# EAGLE design InkTime_Schematic (EAGLE 9.7.0)

## Sheet 1 of 2
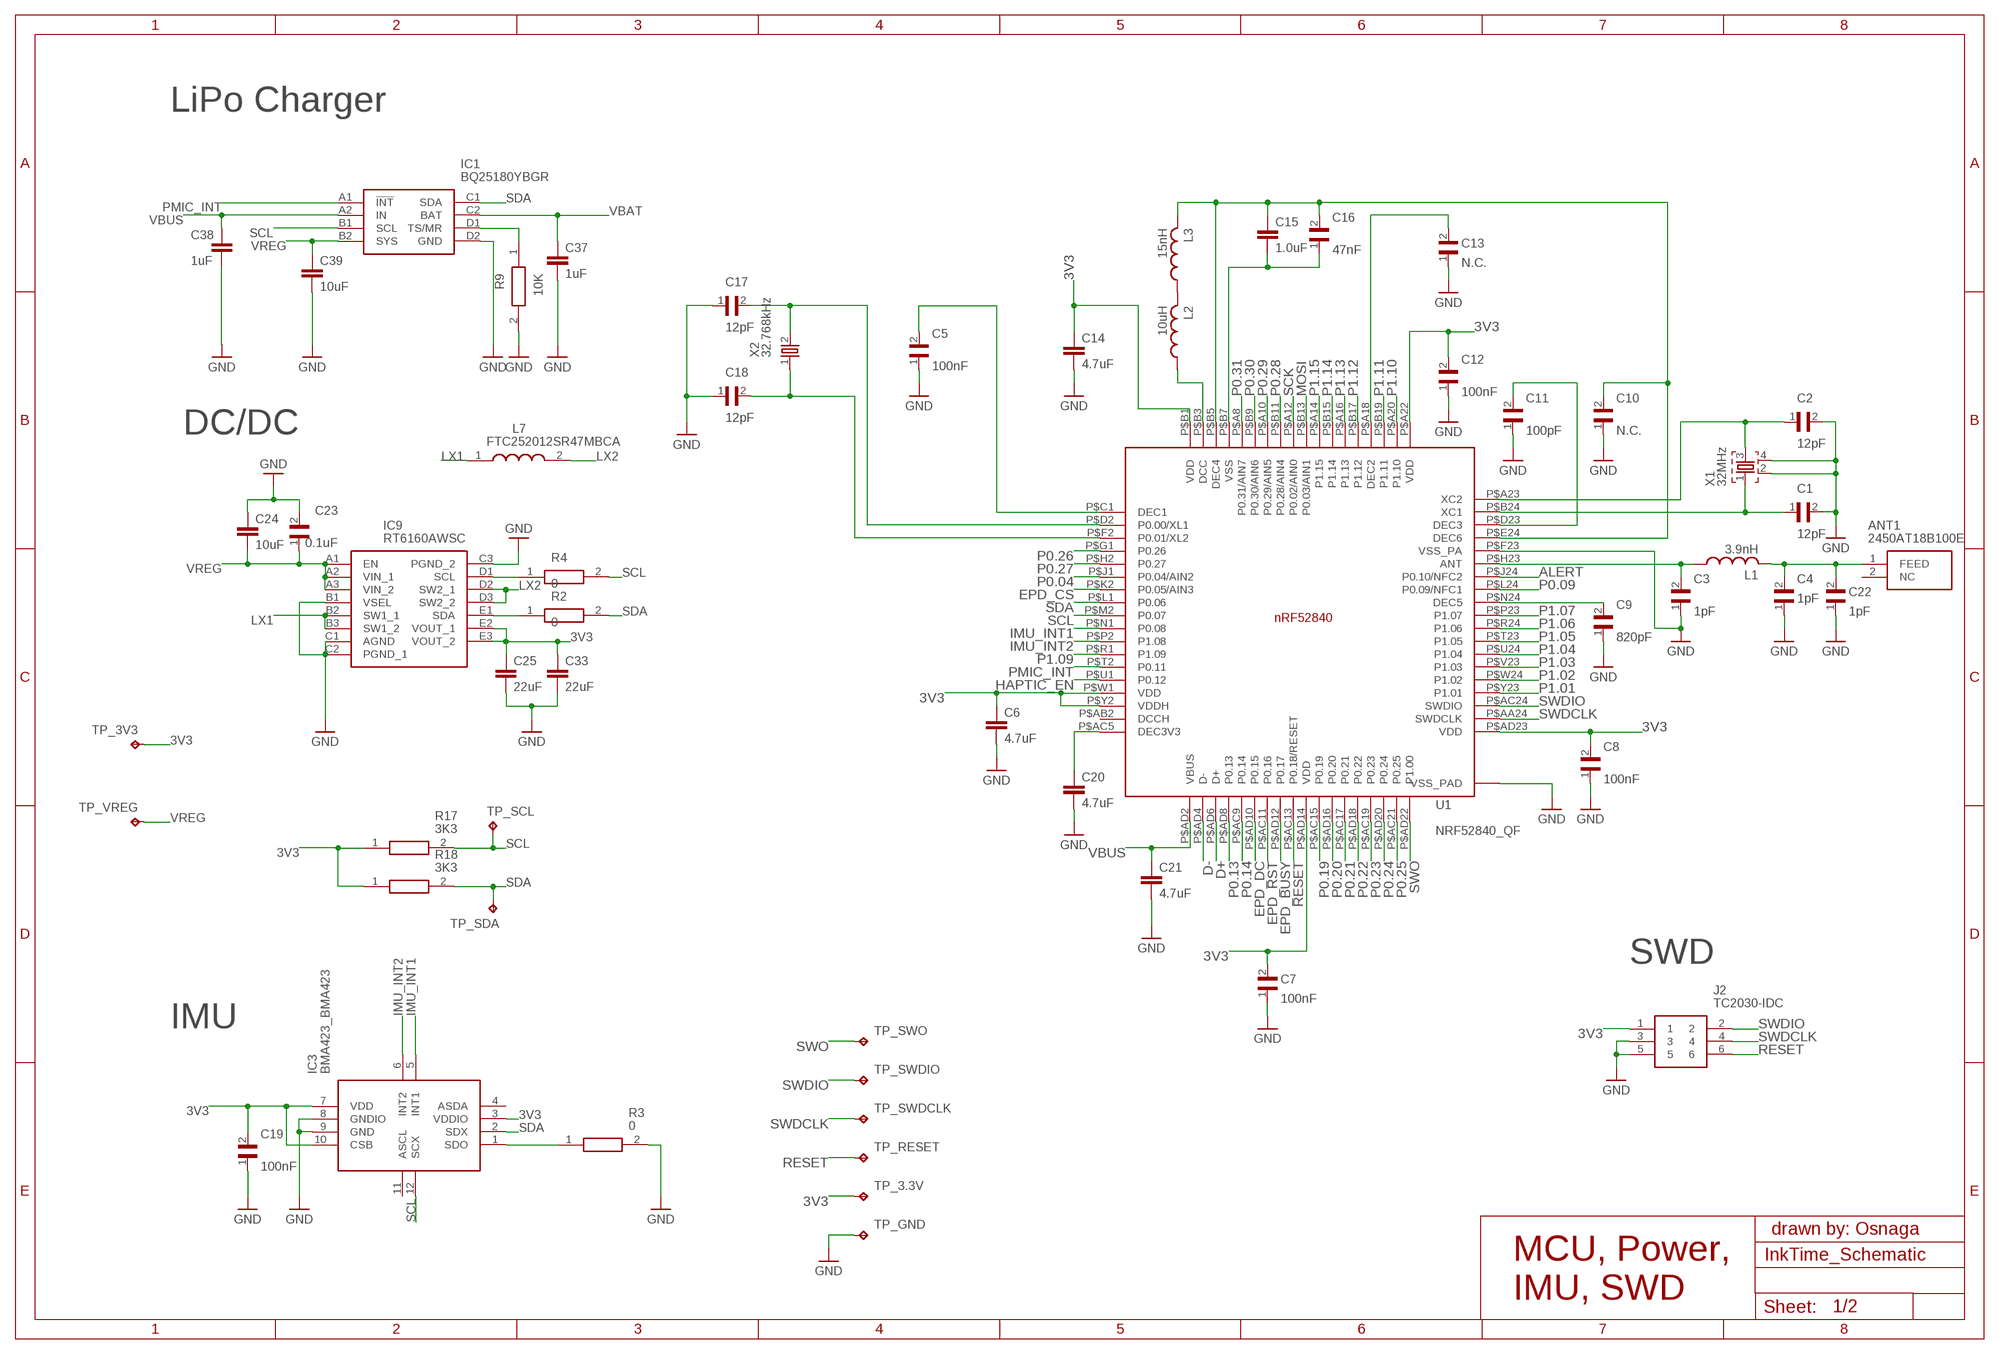
[diagram p0: schematic, sheet 1]

### Parts
ANT1  2450AT18B100E  2450AT18B100E_2450AT18B100E  [2450AT18B100E_ANTC3216X140N]
C1  12pF  GRM011R60J152KE01L_2_GRM011R60J152KE01L  [GRM011R60J152KE01L_2_CAPC0201X13N]
C2  12pF  GRM011R60J152KE01L_2_GRM011R60J152KE01L  [GRM011R60J152KE01L_2_CAPC0201X13N]
C3  1pF  GRM011R60J152KE01L_2_GRM011R60J152KE01L  [GRM011R60J152KE01L_2_CAPC0201X13N]
C4  1pF  GRM011R60J152KE01L_2_GRM011R60J152KE01L  [GRM011R60J152KE01L_2_CAPC0201X13N]
C5  100nF  GRM011R60J152KE01L_2_GRM011R60J152KE01L  [GRM011R60J152KE01L_2_CAPC0201X13N]
C6  4.7uF  PERFECT_0402_CAP_0402  [PERFECT_0402_0402]
C7  100nF  GRM011R60J152KE01L_2_GRM011R60J152KE01L  [GRM011R60J152KE01L_2_CAPC0201X13N]
C8  100nF  GRM011R60J152KE01L_2_GRM011R60J152KE01L  [GRM011R60J152KE01L_2_CAPC0201X13N]
C9  820pF  GRM011R60J152KE01L_2_GRM011R60J152KE01L  [GRM011R60J152KE01L_2_CAPC0201X13N]
C10  N.C.  GRM011R60J152KE01L_2_GRM011R60J152KE01L  [GRM011R60J152KE01L_2_CAPC0201X13N]
C11  100pF  GRM011R60J152KE01L_2_GRM011R60J152KE01L  [GRM011R60J152KE01L_2_CAPC0201X13N]
C12  100nF  GRM011R60J152KE01L_2_GRM011R60J152KE01L  [GRM011R60J152KE01L_2_CAPC0201X13N]
C13  N.C.  GRM011R60J152KE01L_2_GRM011R60J152KE01L  [GRM011R60J152KE01L_2_CAPC0201X13N]
C14  4.7uF  PERFECT_0402_CAP_0402  [PERFECT_0402_0402]
C15  1.0uF  PERFECT_0402_CAP_0402  [PERFECT_0402_0402]
C16  47nF  GRM011R60J152KE01L_2_GRM011R60J152KE01L  [GRM011R60J152KE01L_2_CAPC0201X13N]
C17  12pF  GRM011R60J152KE01L_2_GRM011R60J152KE01L  [GRM011R60J152KE01L_2_CAPC0201X13N]
C18  12pF  GRM011R60J152KE01L_2_GRM011R60J152KE01L  [GRM011R60J152KE01L_2_CAPC0201X13N]
C19  100nF  GRM011R60J152KE01L_2_GRM011R60J152KE01L  [GRM011R60J152KE01L_2_CAPC0201X13N]
C20  4.7uF  PERFECT_0402_CAP_0402  [PERFECT_0402_0402]
C21  4.7uF  PERFECT_0402_CAP_0402  [PERFECT_0402_0402]
C22  1pF  GRM011R60J152KE01L_2_GRM011R60J152KE01L  [GRM011R60J152KE01L_2_CAPC0201X13N]
C23  0.1uF  GRM011R60J152KE01L_2_GRM011R60J152KE01L  [GRM011R60J152KE01L_2_CAPC0201X13N]
C24  10uF  PERFECT_0402_CAP_0402  [PERFECT_0402_0402]
C25  22uF  PERFECT_0402_CAP_0402  [PERFECT_0402_0402]
C33  22uF  PERFECT_0402_CAP_0402  [PERFECT_0402_0402]
C37  1uF  PERFECT_0402_CAP_0402  [PERFECT_0402_0402]
C38  1uF  PERFECT_0402_CAP_0402  [PERFECT_0402_0402]
C39  10uF  PERFECT_0402_CAP_0402  [PERFECT_0402_0402]
IC1  BQ25180YBGR  BQ25180YBGR_BQ25180YBGR  [BQ25180YBGR_BGA8C40P2X4_100X155X50]
IC3  BMA423_BMA423  [BMA423_BMA423]
IC9  RT6160AWSC  RT6160AWSC_RT6160AWSC  [RT6160AWSC_BGA15C40P3X5_140X230X60]
J2  TC2030-IDC  TC2030-IDC_TC2030-IDC  [TC2030-IDC_TC2030IDC]
L1  3.9nH  NORDIC_NRF_2_INDUCTOR_0201_L  [NORDIC_NRF_2_RESC0201_L]
L2  10uH  NORDIC_NRF_2_INDUCTOR_0201_L  [NORDIC_NRF_2_RESC0201_L]
L3  15nH  NORDIC_NRF_2_INDUCTOR_0201_L  [NORDIC_NRF_2_RESC0201_L]
L7  FTC252012SR47MBCA  MLP2016SR47MT0S1_FTC252012SR47MBCA  [MLP2016SR47MT0S1_INDC2016X100N]
R2  0  CPF0201D7K68C1_CPF0201D7K68C1  [CPF0201D7K68C1_0201]
R3  0  CPF0201D7K68C1_CPF0201D7K68C1  [CPF0201D7K68C1_0201]
R4  0  CPF0201D7K68C1_CPF0201D7K68C1  [CPF0201D7K68C1_0201]
R9  10K  CPF0201D7K68C1_CPF0201D7K68C1  [CPF0201D7K68C1_0201]
R17  3K3  CPF0201D7K68C1_CPF0201D7K68C1  [CPF0201D7K68C1_0201]
R18  3K3  CPF0201D7K68C1_CPF0201D7K68C1  [CPF0201D7K68C1_0201]
TP_3.3V  HECTOR_WATCH_1_TPTP20R  [HECTOR_WATCH_1_TP20R]
TP_3V3  HECTOR_WATCH_1_TPTP20R  [HECTOR_WATCH_1_TP20R]
TP_GND  HECTOR_WATCH_1_TPTP20R  [HECTOR_WATCH_1_TP20R]
TP_RESET  HECTOR_WATCH_1_TPTP20R  [HECTOR_WATCH_1_TP20R]
TP_SCL  HECTOR_WATCH_1_TPTP20R  [HECTOR_WATCH_1_TP20R]
TP_SDA  HECTOR_WATCH_1_TPTP20R  [HECTOR_WATCH_1_TP20R]
TP_SWDCLK  HECTOR_WATCH_1_TPTP20R  [HECTOR_WATCH_1_TP20R]
TP_SWDIO  HECTOR_WATCH_1_TPTP20R  [HECTOR_WATCH_1_TP20R]
TP_SWO  HECTOR_WATCH_1_TPTP20R  [HECTOR_WATCH_1_TP20R]
TP_VREG  HECTOR_WATCH_1_TPTP20R  [HECTOR_WATCH_1_TP20R]
U1  NRF52840_QF  NORDIC_NRF_4_NRF52840_QF  [NORDIC_NRF_4_AQFN50P700X700X85_HS-74N]
X1  32MHz  NORDIC_NRF_XTAL_32MHZ  [NORDIC_NRF_BT-XTAL_2016_N]
X2  32.768kHz  NORDIC_NRF_1_XTAL_32KHZ  [NORDIC_NRF_1_XTAL_3215_N]

### Nets
3V3: C6.1 C7.2 C8.2 C12.2 C14.1 C19.2 C25.1 C33.1 IC3.3(VDDIO) IC3.7(VDD) IC3.10(CSB) IC9.E2(VOUT_1) IC9.E3(VOUT_2) J2.1 R17.1 R18.1 TP_3.3V.TP TP_3V3.TP U1.P$A22(VDD) U1.P$AD14(VDD) U1.P$AD23(VDD) U1.P$B1(VDD) U1.P$W1(VDD) U1.P$Y2(VDDH) ; also sheet 2
ALERT: U1.P$J24(P0.10/NFC2) ; also sheet 2
D+: U1.P$AD6(D+) ; also sheet 2
D-: U1.P$AD4(D-) ; also sheet 2
EPD_BUSY: U1.P$AD12(P0.17) ; also sheet 2
EPD_CS: U1.P$K2(P0.05/AIN3) ; also sheet 2
EPD_DC: U1.P$AD10(P0.15) ; also sheet 2
EPD_RST: U1.P$AC11(P0.16) ; also sheet 2
GND: C1.2 C2.2 C3.1 C4.1 C5.1 C6.2 C7.1 C8.1 C9.1 C10.1 C11.1 C12.1 C13.1 C14.2 C17.1 C18.1 C19.1 C20.2 C21.2 C22.1 C23.2 C24.1 C25.2 C33.2 C37.2 C38.2 C39.2 IC1.D2(GND) IC3.8(GNDIO) IC3.9(GND) IC9.B1(VSEL) IC9.C1(AGND) IC9.C2(PGND_1) IC9.C3(PGND_2) J2.3 J2.5 R3.2 R9.2 TP_GND.TP U1.P$74(VSS_PAD) U1.P$75(VSS_PAD) U1.P$76(VSS_PAD) U1.P$77(VSS_PAD) U1.P$78(VSS_PAD) U1.P$79(VSS_PAD) U1.P$80(VSS_PAD) U1.P$81(VSS_PAD) U1.P$82(VSS_PAD) U1.P$83(VSS_PAD) U1.P$84(VSS_PAD) U1.P$85(VSS_PAD) U1.P$86(VSS_PAD) U1.P$87(VSS_PAD) U1.P$88(VSS_PAD) U1.P$89(VSS_PAD) U1.P$90(VSS_PAD) U1.P$F23(VSS_PA) X1.2 X1.4 ; also sheet 2
HAPTIC_EN: U1.P$U1(P0.12) ; also sheet 2
IMU_INT1: IC3.5(INT1) U1.P$N1(P0.08)
IMU_INT2: IC3.6(INT2) U1.P$P2(P1.08)
LX1: IC9.B2(SW1_1) IC9.B3(SW1_2) L7.1
LX2: IC9.D2(SW2_1) IC9.D3(SW2_2) L7.2
MOSI: U1.P$B13(P0.03/AIN1) ; also sheet 2
N$1: IC9.D1(SCL) R4.1
N$2: IC9.E1(SDA) R2.1
N$3: C20.1 U1.P$AC5(DEC3V3)
N$4: C5.2 U1.P$C1(DEC1)
N$5: IC3.1(SDO) R3.1
N$6: IC1.D1(TS/MR) R9.1
N$7: C17.2 U1.P$D2(P0.00/XL1) X2.2
N$8: L2.2 L3.1
N$9: L2.1 U1.P$B3(DCC)
N$11: C18.2 U1.P$F2(P0.01/XL2) X2.1
N$12: C15.2 C16.1 U1.P$B7(VSS)
N$15: C11.2 U1.P$D23(DEC3)
N$16: C2.1 U1.P$A23(XC2) X1.3
N$17: C1.1 U1.P$B24(XC1) X1.1
N$19: C3.2 L1.1 U1.P$H23(ANT)
N$20: ANT1.1(FEED) C4.2 C22.2 L1.2
N$24: C13.2 U1.P$A18(DEC2)
N$25: C9.2 U1.P$N24(DEC5)
N$35: C10.2 C15.1 C16.2 L3.2 U1.P$B5(DEC4) U1.P$E24(DEC6)
P0.04: U1.P$J1(P0.04/AIN2)
P0.09: U1.P$L24(P0.09/NFC1)
P0.13: U1.P$AD8(P0.13) ; also sheet 2
P0.14: U1.P$AC9(P0.14) ; also sheet 2
P0.19: U1.P$AC15(P0.19)
P0.20: U1.P$AD16(P0.20)
P0.21: U1.P$AC17(P0.21)
P0.22: U1.P$AD18(P0.22)
P0.23: U1.P$AC19(P0.23)
P0.24: U1.P$AD20(P0.24)
P0.25: U1.P$AC21(P0.25)
P0.26: U1.P$G1(P0.26)
P0.27: U1.P$H2(P0.27)
P0.28: U1.P$B11(P0.28/AIN4)
P0.29: U1.P$A10(P0.29/AIN5)
P0.30: U1.P$B9(P0.30/AIN6)
P0.31: U1.P$A8(P0.31/AIN7)
P1.01: U1.P$Y23(P1.01) ; also sheet 2
P1.02: U1.P$W24(P1.02) ; also sheet 2
P1.03: U1.P$V23(P1.03)
P1.04: U1.P$U24(P1.04)
P1.05: U1.P$T23(P1.05)
P1.06: U1.P$R24(P1.06)
P1.07: U1.P$P23(P1.07)
P1.09: U1.P$R1(P1.09)
P1.10: U1.P$A20(P1.10)
P1.11: U1.P$B19(P1.11)
P1.12: U1.P$B17(P1.12)
P1.13: U1.P$A16(P1.13)
P1.14: U1.P$B15(P1.14)
P1.15: U1.P$A14(P1.15)
PMIC_INT: IC1.A1(!INT) U1.P$T2(P0.11)
RESET: J2.6 TP_RESET.TP U1.P$AC13(P0.18/RESET)
SCK: U1.P$A12(P0.02/AIN0) ; also sheet 2
SCL: IC1.B1(SCL) IC3.12(SCX) R4.2 R17.2 TP_SCL.TP U1.P$M2(P0.07) ; also sheet 2
SDA: IC1.C1(SDA) IC3.2(SDX) R2.2 R18.2 TP_SDA.TP U1.P$L1(P0.06) ; also sheet 2
SWDCLK: J2.4 TP_SWDCLK.TP U1.P$AA24(SWDCLK)
SWDIO: J2.2 TP_SWDIO.TP U1.P$AC24(SWDIO)
SWO: TP_SWO.TP U1.P$AD22(P1.00)
VBAT: C37.1 IC1.C2(BAT) ; also sheet 2
VBUS: C21.1 C38.1 IC1.A2(IN) U1.P$AD2(VBUS) ; also sheet 2
VREG: C23.1 C24.2 C39.1 IC1.B2(SYS) IC9.A1(EN) IC9.A2(VIN_1) IC9.A3(VIN_2) TP_VREG.TP
Unconnected: ANT1.2(NC) IC3.4(ASDA) IC3.11(ASCL) U1.P$AB2(DCCH)

### Notes on the sheet
- LiPo Charger
- DC/DC
- SWD
- IMU
- drawn by: Osnaga
- MCU, Power,
  IMU, SWD

## Sheet 2 of 2
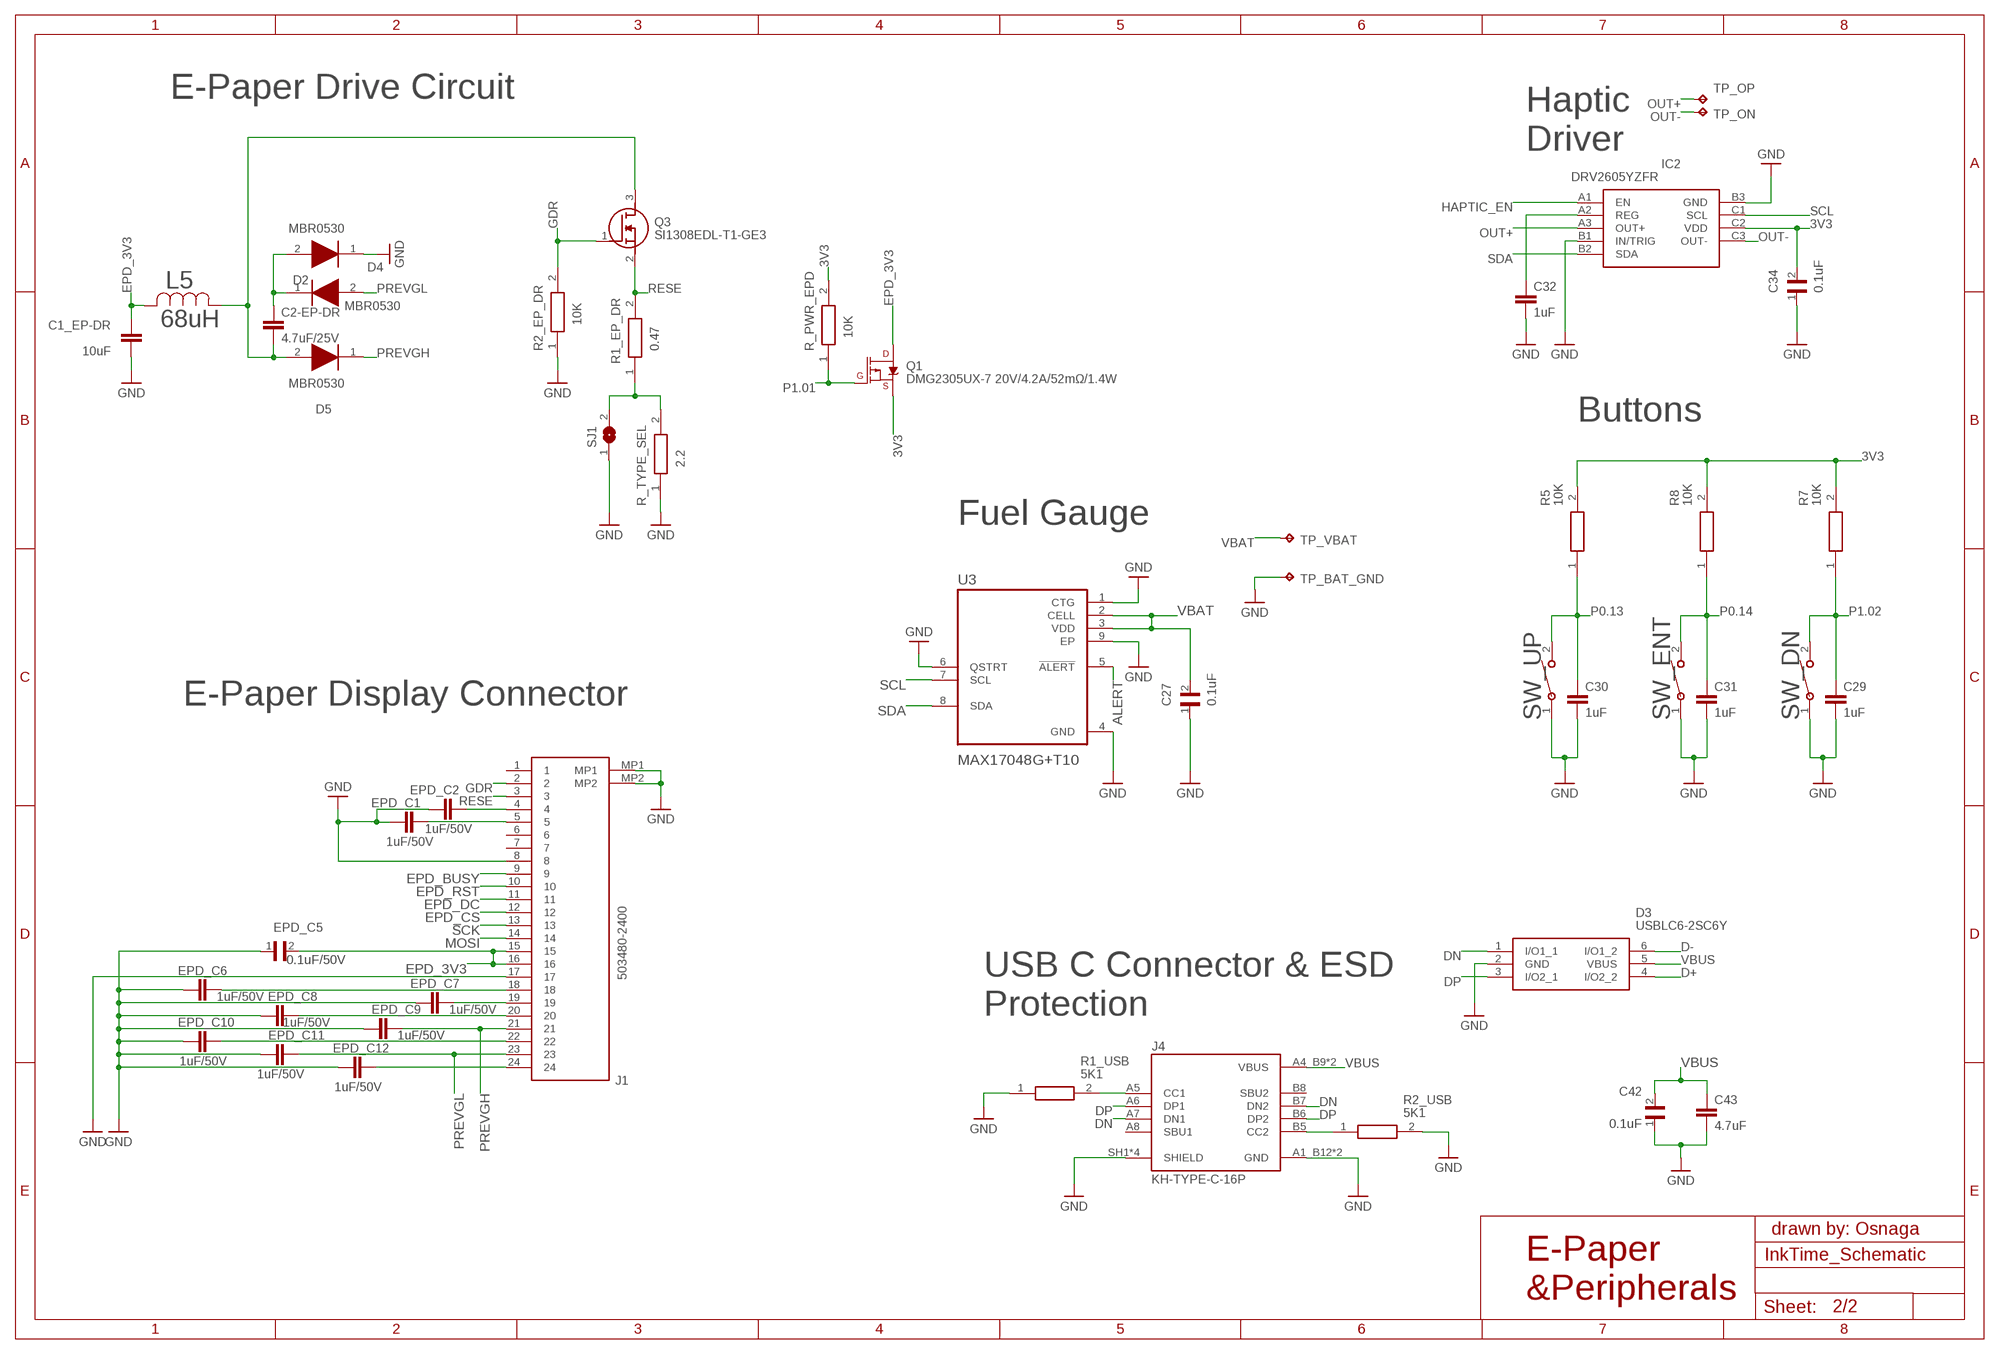
[diagram p1: schematic, sheet 2]

### Parts
C1_EP-DR  10uF  PERFECT_0402_CAP_0402  [PERFECT_0402_0402]
C2-EP-DR  4.7uF/25V  PERFECT_0402_CAP_0402  [PERFECT_0402_0402]
C27  0.1uF  GRM011R60J152KE01L_2_GRM011R60J152KE01L  [GRM011R60J152KE01L_2_CAPC0201X13N]
C29  1uF  PERFECT_0402_CAP_0402  [PERFECT_0402_0402]
C30  1uF  PERFECT_0402_CAP_0402  [PERFECT_0402_0402]
C31  1uF  PERFECT_0402_CAP_0402  [PERFECT_0402_0402]
C32  1uF  PERFECT_0402_CAP_0402  [PERFECT_0402_0402]
C34  0.1uF  GRM011R60J152KE01L_2_GRM011R60J152KE01L  [GRM011R60J152KE01L_2_CAPC0201X13N]
C42  0.1uF  GRM011R60J152KE01L_2_GRM011R60J152KE01L  [GRM011R60J152KE01L_2_CAPC0201X13N]
C43  4.7uF  PERFECT_0402_CAP_0402  [PERFECT_0402_0402]
D2  MBR0530  ESP32_C6_LIBRARY_5_MBR0530  [ESP32_C6_LIBRARY_5_SOD3716X135N]
D3  USBLC6-2SC6Y  ESP32_C6_LIBRARY_3_USBLC6-2SC6Y  [ESP32_C6_LIBRARY_3_SOT95P280X145-6N]
D4  MBR0530  ESP32_C6_LIBRARY_5_MBR0530  [ESP32_C6_LIBRARY_5_SOD3716X135N]
D5  MBR0530  ESP32_C6_LIBRARY_5_MBR0530  [ESP32_C6_LIBRARY_5_SOD3716X135N]
EPD_C1  1uF/50V  PERFECT_0402_CAP_0402  [PERFECT_0402_0402]
EPD_C2  1uF/50V  PERFECT_0402_CAP_0402  [PERFECT_0402_0402]
EPD_C5  0.1uF/50V  GRM011R60J152KE01L_2_GRM011R60J152KE01L  [GRM011R60J152KE01L_2_CAPC0201X13N]
EPD_C6  1uF/50V  PERFECT_0402_CAP_0402  [PERFECT_0402_0402]
EPD_C7  1uF/50V  PERFECT_0402_CAP_0402  [PERFECT_0402_0402]
EPD_C8  1uF/50V  PERFECT_0402_CAP_0402  [PERFECT_0402_0402]
EPD_C9  1uF/50V  PERFECT_0402_CAP_0402  [PERFECT_0402_0402]
EPD_C10  1uF/50V  PERFECT_0402_CAP_0402  [PERFECT_0402_0402]
EPD_C11  1uF/50V  PERFECT_0402_CAP_0402  [PERFECT_0402_0402]
EPD_C12  1uF/50V  PERFECT_0402_CAP_0402  [PERFECT_0402_0402]
IC2  DRV2605YZFR  DRV2605YZFR_DRV2605YZFR  [DRV2605YZFR_BGA9C50P3X3_144X144X62]
J1  503480-2400  503480-2400_503480-2400  [503480-2400_5034802400]
J4  KH-TYPE-C-16P  KH-TYPE-C-16P_KH-TYPE-C-16P  [KH-TYPE-C-16P_KINGHELM_KH-TYPE-C-16P]
L5  68uH  ESP32_C6_LIBRARY_2_744043680IND_4828-WE-TPC_WRE  [ESP32_C6_LIBRARY_2_IND_4828-WE-TPC_WRE]
Q1  DMG2305UX-7 20V/4.2A/52mΩ/1.4W  ESP32_C6_LIBRARY_4_ESP32_WROVER_SPARKFUN-DISCRETESEMI_MOSFET_PCH-DMG2305UX-7  [ESP32_C6_LIBRARY_4_ESP32_C6_LIBRARY_4_ESP32_C6_LIBRARY_4_ESP32_C6_LIBRARY_4_ESP32_WROVER_SPARKFUN-DISCRETESEMI_SOT23-3]
Q3  SI1308EDL-T1-GE3  ESP32_C6_LIBRARY_6_SI1308EDL-T1-GE3  [ESP32_C6_LIBRARY_6_SOT65P210X110-3N]
R1_EP_DR  0.47  CPF0201D7K68C1_CPF0201D7K68C1  [CPF0201D7K68C1_0201]
R1_USB  5K1  CPF0201D7K68C1_CPF0201D7K68C1  [CPF0201D7K68C1_0201]
R2_EP_DR  10K  CPF0201D7K68C1_CPF0201D7K68C1  [CPF0201D7K68C1_0201]
R2_USB  5K1  CPF0201D7K68C1_CPF0201D7K68C1  [CPF0201D7K68C1_0201]
R5  10K  CPF0201D7K68C1_CPF0201D7K68C1  [CPF0201D7K68C1_0201]
R7  10K  CPF0201D7K68C1_CPF0201D7K68C1  [CPF0201D7K68C1_0201]
R8  10K  CPF0201D7K68C1_CPF0201D7K68C1  [CPF0201D7K68C1_0201]
R_PWR_EPD  10K  CPF0201D7K68C1_CPF0201D7K68C1  [CPF0201D7K68C1_0201]
R_TYPE_SEL  2.2  CPF0201D7K68C1_CPF0201D7K68C1  [CPF0201D7K68C1_0201]
SJ1  ESP32_C6_LIBRARY_7_JUMPER_SJ  [ESP32_C6_LIBRARY_7_JUMPER_SJ]
SW_DN  2025-10-22_07-23-44_LIBRARY_EVP-AKE31ASW_EVP-AKE31A_PAN  [2025-10-22_07-23-44_LIBRARY_SW_EVP-AKE31A_PAN]
SW_ENT  2025-10-22_07-23-44_LIBRARY_EVP-AKE31ASW_EVP-AKE31A_PAN  [2025-10-22_07-23-44_LIBRARY_SW_EVP-AKE31A_PAN]
SW_UP  2025-10-22_07-23-44_LIBRARY_EVP-AKE31ASW_EVP-AKE31A_PAN  [2025-10-22_07-23-44_LIBRARY_SW_EVP-AKE31A_PAN]
TP_BAT_GND  HECTOR_WATCH_1_TPTP20R  [HECTOR_WATCH_1_TP20R]
TP_ON  HECTOR_WATCH_1_TPTP20R  [HECTOR_WATCH_1_TP20R]
TP_OP  HECTOR_WATCH_1_TPTP20R  [HECTOR_WATCH_1_TP20R]
TP_VBAT  HECTOR_WATCH_1_TPTP20R  [HECTOR_WATCH_1_TP20R]
U3  MAX17048G+T10  ESP32_C6_LIBRARY_MAX17048G+T10  [ESP32_C6_LIBRARY_SON50P200X200X80-9N]

### Nets
3V3: C34.2 IC2.C2(VDD) Q1.2(S) R5.2 R7.2 R8.2 R_PWR_EPD.2 ; also sheet 1
ALERT: U3.5(!ALERT) ; also sheet 1
D+: D3.4(I/O2_2) ; also sheet 1
D-: D3.6(I/O1_2) ; also sheet 1
DN: D3.1(I/O1_1) J4.A7(DN1) J4.B7(DN2)
DP: D3.3(I/O2_1) J4.A6(DP1) J4.B6(DP2)
EPD_3V3: C1_EP-DR.1 EPD_C5.2 J1.15 J1.16 L5.2 Q1.3(D)
EPD_BUSY: J1.9 ; also sheet 1
EPD_CS: J1.12 ; also sheet 1
EPD_DC: J1.11 ; also sheet 1
EPD_RST: J1.10 ; also sheet 1
GDR: J1.2 Q3.1(G) R2_EP_DR.2
GND: C1_EP-DR.2 C27.1 C29.2 C30.2 C31.2 C32.2 C34.1 C42.1 C43.2 D3.2(GND) D4.1(K) EPD_C1.1 EPD_C2.1 EPD_C5.1 EPD_C6.1 EPD_C7.1 EPD_C8.1 EPD_C9.1 EPD_C10.1 EPD_C11.1 EPD_C12.1 IC2.B1(IN/TRIG) IC2.B3(GND) J1.8 J1.17 J1.MP1 J1.MP2 J4.A1_B12(GND) J4.A12_B1(GND) J4.SH1(SHIELD) J4.SH2(SHIELD) J4.SH3(SHIELD) J4.SH4(SHIELD) R1_USB.1 R2_EP_DR.1 R2_USB.2 R_TYPE_SEL.1 SJ1.1 SW_DN.1 SW_ENT.1 SW_UP.1 TP_BAT_GND.TP U3.1(CTG) U3.4(GND) U3.6(QSTRT) U3.9(EP) ; also sheet 1
HAPTIC_EN: IC2.A1(EN) ; also sheet 1
MOSI: J1.14 ; also sheet 1
N$22: EPD_C6.2 J1.18
N$23: EPD_C7.2 J1.19
N$26: EPD_C8.2 J1.20
N$27: J4.B5(CC2) R2_USB.1
N$28: EPD_C10.2 J1.22
N$30: EPD_C2.2 J1.4
N$31: EPD_C1.2 J1.5
N$32: EPD_C12.2 J1.24
N$33: R1_EP_DR.1 R_TYPE_SEL.2 SJ1.2
N$34: C2-EP-DR.2 D5.2(A) L5.1 Q3.3(D)
N$37: J4.A5(CC1) R1_USB.2
N$39: C2-EP-DR.1 D2.1(K) D4.2(A)
N$43: C32.1 IC2.A2(REG)
OUT+: IC2.A3(OUT+) TP_OP.TP
OUT-: IC2.C3(OUT-) TP_ON.TP
P0.13: C30.1 R5.1 SW_UP.2 ; also sheet 1
P0.14: C31.1 R8.1 SW_ENT.2 ; also sheet 1
P1.01: Q1.1(G) R_PWR_EPD.1 ; also sheet 1
P1.02: C29.1 R7.1 SW_DN.2 ; also sheet 1
PREVGH: D5.1(K) EPD_C9.2 J1.21
PREVGL: D2.2(A) EPD_C11.2 J1.23
RESE: J1.3 Q3.2(S) R1_EP_DR.2
SCK: J1.13 ; also sheet 1
SCL: IC2.C1(SCL) U3.7(SCL) ; also sheet 1
SDA: IC2.B2(SDA) U3.8(SDA) ; also sheet 1
VBAT: C27.2 TP_VBAT.TP U3.2(CELL) U3.3(VDD) ; also sheet 1
VBUS: C42.2 C43.1 D3.5(VBUS) J4.A4_B9(VBUS) J4.A9_B4(VBUS) ; also sheet 1
Unconnected: J1.1 J1.6 J1.7 J4.A8(SBU1) J4.B8(SBU2)

### Notes on the sheet
- E-Paper Drive Circuit
- Haptic
  Driver
- Buttons
- Fuel Gauge
- E-Paper Display Connector
- USB C Connector & ESD
  Protection
- drawn by: Osnaga
- E-Paper
  &Peripherals

## Library data of the parts
ANT1 = InkTime_v5:2450AT18B100E_2450AT18B100E: Antennas 2.45GHz ANTENNA Source: Datasheet <https://www.johansontechnology.com/datasheets/2450AT18B100/2450AT18B100.pdf>
C1-C5 C7-C13 C16-C19 C22 C23 C27 C34 C42 EPD_C5 = InkTime_v5:GRM011R60J152KE01L_2_GRM011R60J152KE01L: Check availability <https://pricing.snapeda.com/parts/GRM011R60J152KE01L/Murata/view-part?ref=eda>
C1_EP-DR C2-EP-DR C6 C14 C15 C20 C21 C24 C25 C29-C33 C37-C39 C43 EPD_C1 EPD_C2 EPD_C6-EPD_C12 = InkTime_v5:PERFECT_0402_CAP_0402: 0402 (1005 Metric) Nick Garner - TeleSense
D2 D4 D5 = InkTime_v5:ESP32_C6_LIBRARY_5_MBR0530: ON SEMICONDUCTOR - MBR0530 - DIODE, SCHOTTKY, 0.5A, 30V, SOD-123 Source: Datasheet <http://www.onsemi.com/pub/Collateral/MBR0530T1-D.PDF> Check availability <https://pricing.snapeda.com/parts/MBR0530/ON%20Semiconductor/view-part?ref=eda>
D3 = InkTime_v5:ESP32_C6_LIBRARY_3_USBLC6-2SC6Y: Low Cap. ESD Protection Auto SOT-23-6 STMicroelectronics USBLC6-2SC6Y, Dual Uni-Directional TVS Diode Array, 6-Pin SOT-23 Source: Datasheet <https://componentsearchengine.com/Datasheets/1/USBLC6-2SC6Y.pdf> Check availability <https://pricing.snapeda.com/parts/USBLC6-2SC6Y/STMicroelectronics/view-part?ref=eda>
IC1 = InkTime_v5:BQ25180YBGR_BQ25180YBGR: Charger IC Lithium Ion/Polymer, Lithium Iron Phosphate 8-DSBGA (1.6x1.1) Source: Datasheet <https://www.ti.com/lit/ds/symlink/bq25180.pdf?ts=1650264094470&ref_url=https%3A%2F%2Fwww.ti.com%2Fproduct%2FBQ25180>
IC2 = InkTime_v5:DRV2605YZFR_DRV2605YZFR: Haptic Driver for ERM/LRA with Built-In Library and Smart Loop Architecture Source: Datasheet <http://www.ti.com/lit/gpn/drv2605>
IC3 = InkTime_v5:BMA423_BMA423: Accelerometers Triaxial low-g 12bit Acceleration Sensor Source: Datasheet <https://www.mouser.com/datasheet/2/783/BST-BMA423-DS000-1509600.pdf>
IC9 = InkTime_v5:RT6160AWSC_RT6160AWSC: Buck-Boost Regulator Positive Output Step-Up/Step-Down I2C DC-DC Controller IC 15-WL-CSP (BSC) (1.4x2.3) Source: Datasheet <https://www.richtek.com/SaveDownload.aspx?specid=RT6160A>
J1 = InkTime_v5:503480-2400_503480-2400: FFC & FPC Connectors 0.5mm FPC RA SMT Dual Contact 24Ckt Source: Datasheet <https://componentsearchengine.com/Datasheets/1/503480-2400.pdf>
J2 = InkTime_v5:TC2030-IDC_TC2030-IDC: CABLE ADAPTER 6 POS Source: Datasheet <https://datasheet.datasheetarchive.com/originals/distributors/Datasheets_SAMA/62bc384e093448baaaa63dbd0b9d8707.pdf>
J4 = InkTime_v5:KH-TYPE-C-16P_KH-TYPE-C-16P: Check availability <https://pricing.snapeda.com/parts/KH-TYPE-C-16P/kinghelm/view-part?ref=eda>
L1-L3 = InkTime_v5:NORDIC_NRF_2_INDUCTOR: Generic chip inductor
L5 = InkTime_v5:ESP32_C6_LIBRARY_2_744043680
L7 = InkTime_v5:MLP2016SR47MT0S1_FTC252012SR47MBCA: SMD / SMT Inductors (Coils), L=0.47?H, L x W x T : Source: Datasheet <https://product.tdk.com/system/files/dam/doc/product/inductor/inductor/smd/catalog/inductor_commercial_power_mlp2016_en.pdf>
Q1 = InkTime_v5:ESP32_C6_LIBRARY_4_ESP32_WROVER_SPARKFUN-DISCRETESEMI_MOSFET_PCH: P-channel MOSFETs Voltage controlled devices that allow control of high current outputs. SparkFun Products: SparkFun ESP32 Thing <https://www.sparkfun.com/products/13907> SparkFun ESP8266 Thing <https://www.sparkfun.com/products/13231> SparkFun Pi Servo HAT V2 <https://www.sparkfun.com/products/15316> DMG2305UX-7 (20V/4.2A/SOT23-3)
Q3 = InkTime_v5:ESP32_C6_LIBRARY_6_SI1308EDL-T1-GE3: MOSFET N-Ch 30V 1.5A TrenchFET SC70 Vishay Si1308EDL-T1-GE3 N-channel MOSFET Transistor, 1.5 A, 30 V, 3-Pin SC-70 Source: Datasheet <https://componentsearchengine.com/Datasheets/1/SI1308EDL-T1-GE3.pdf> Check availability <https://pricing.snapeda.com/parts/SI1308EDL-T1-GE3/Vishay%20Siliconix/view-part?ref=eda>
R1_EP_DR R1_USB R2 R2_EP_DR R2_USB R3-R5 R7-R9 R17 R18 R_PWR_EPD R_TYPE_SEL = InkTime_v5:CPF0201D7K68C1_CPF0201D7K68C1: 7.68k 0201 Thin Film Surface Mount Fixed Resistor +/-0.5% 0.031W CPF0201D7K68C1 Source: Datasheet <http://www.te.com/commerce/DocumentDelivery/DDEController?Action=showdoc&DocId=Data Sheet1773200-1ApdfEnglishENG_DS_1773200-1_A.pdf4-2176215-6>
SJ1 = InkTime_v5:ESP32_C6_LIBRARY_7_JUMPER_SJ: SMD solder JUMPER
SW_DN SW_ENT SW_UP = InkTime_v5:2025-10-22_07-23-44_LIBRARY_EVP-AKE31A
TP_3.3V TP_3V3 TP_BAT_GND TP_GND TP_ON TP_OP TP_RESET TP_SCL TP_SDA TP_SWDCLK TP_SWDIO TP_SWO TP_VBAT TP_VREG = InkTime_v5:HECTOR_WATCH_1_TP: Test pad
U1 = InkTime_v5:NORDIC_NRF_4_NRF52840_QF: nRF52840 Features Advanced Single chip 2.4 GHz multi-protocol SoC 32-bit ARM Cortex-M4F Processor 1.7v to 5.5v operation 1MB flash + 256kB RAM Bluetooth 5 support for long range and high throughput 802.15.4 radio support On-chip NFC PPI –Programmable Peripheral Interconnect Automated power management system with automatic power management of each peripheral Configurable I/O mapping for analog and digital I/O 48 x GPIO 1 x QSPI 4 x Master/Slave SPI 2 x Two-wire interface (I²C) I²S interface 2 x UART 4 x PWM USB 2.0 controller ARM TrustZone CryptoCell-310 Cryptographic and security module AES 128-bit ECB/CCM/AAR hardware accelerator Digital microphone interface (PDM) Quadrature decoder 12-bit ADC Low power comparator On-chip 50Ω balun On-air compatible with nRF52, nRF51 and nRF24 Series Applications Advanced high performance wearables Wearables for secure payments Virtual Reality/Augmented Reality systems Smart Home sensor networks Smart city sensor networks High performance HID controllers Internet of Things (IoT) sensor networks Smart door locks Smart lighting networks Connected white goods
U3 = InkTime_v5:ESP32_C6_LIBRARY_MAX17048G+T10: Check availability <https://pricing.snapeda.com/parts/MAX17048G%2BT10/Analog%20Devices/view-part?ref=eda>
X1 = InkTime_v5:NORDIC_NRF_XTAL_32MHZ
X2 = InkTime_v5:NORDIC_NRF_1_XTAL_32KHZ

## Board
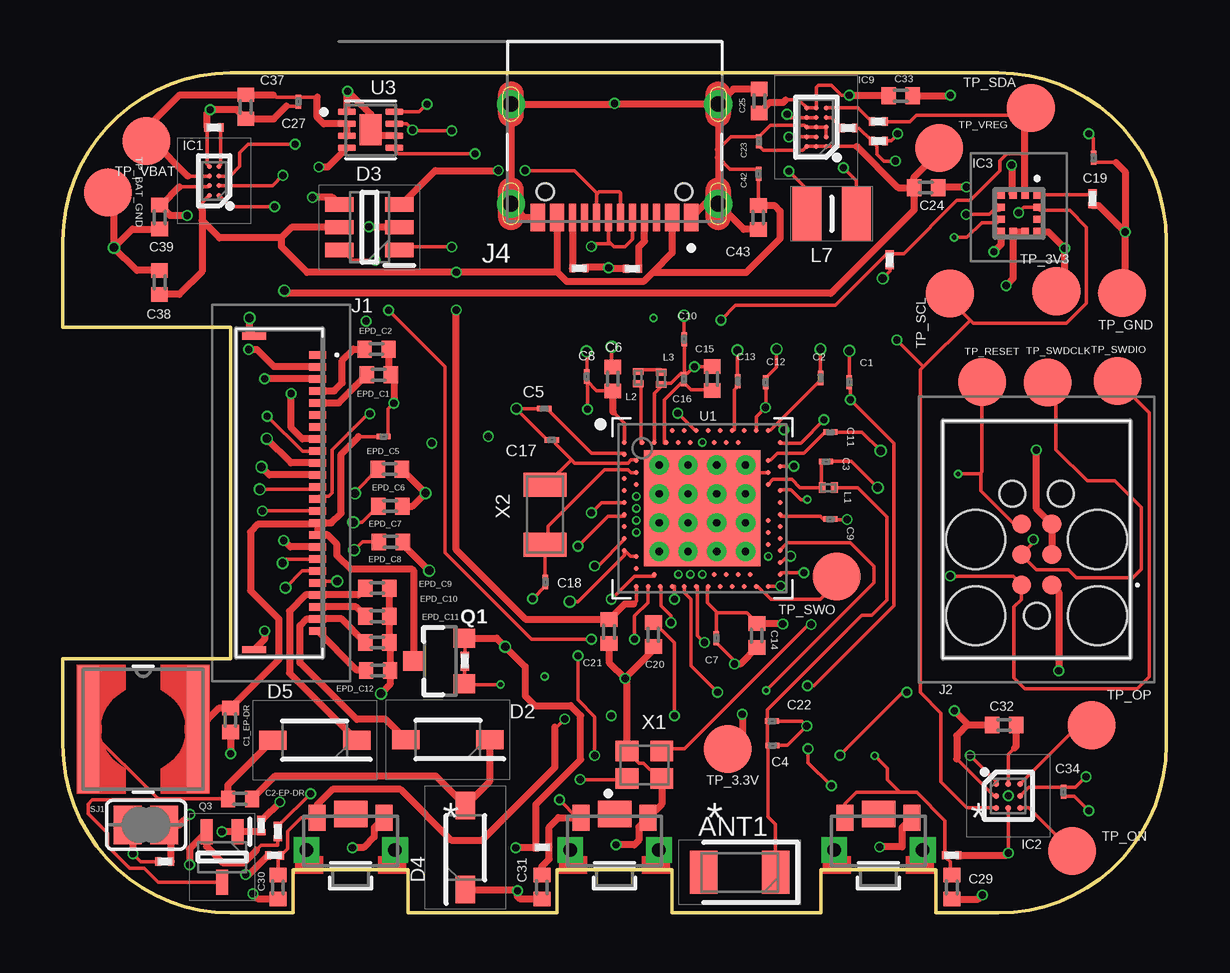
[diagram p2: board, top side]
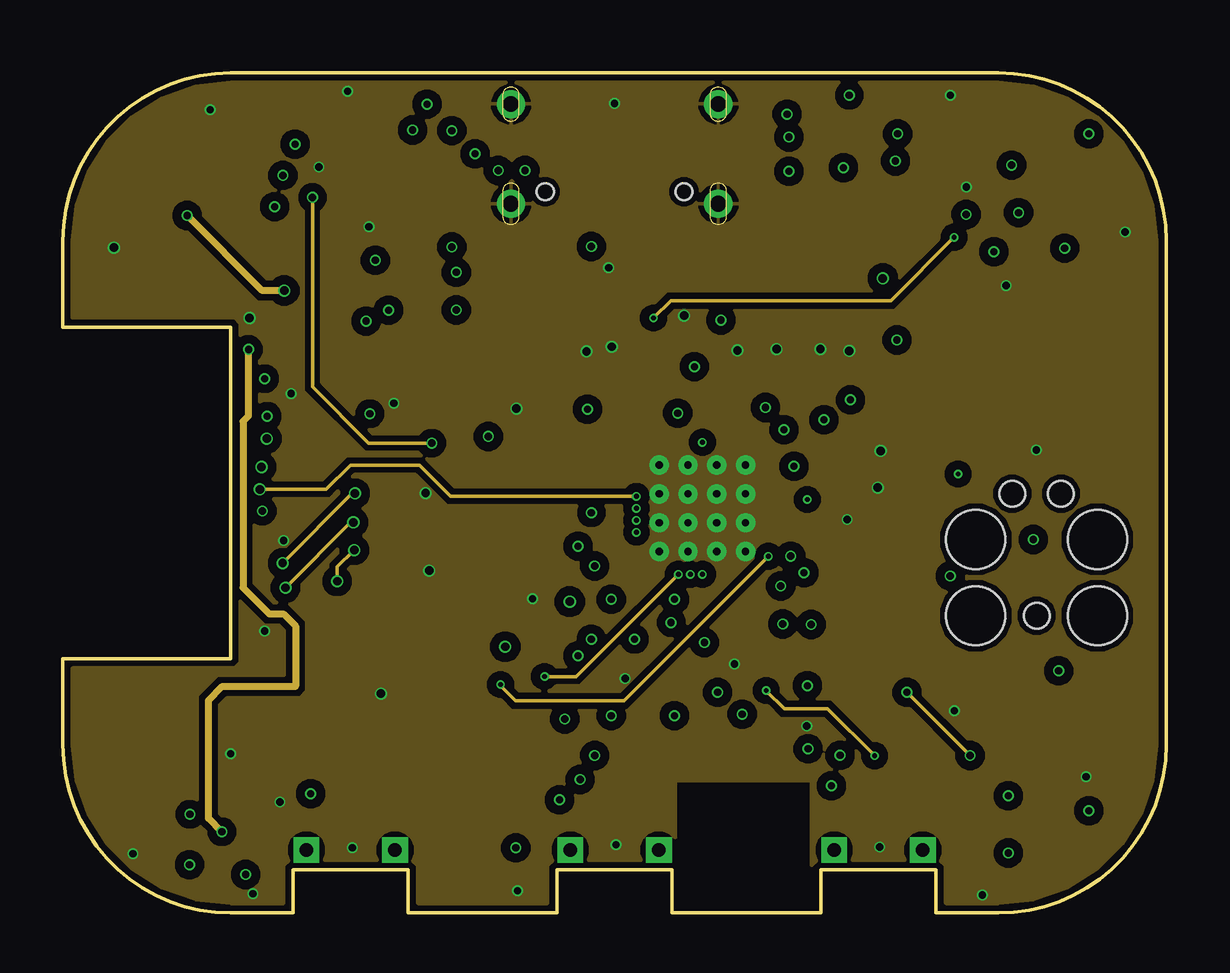
[diagram p3: board, inner layer GND]
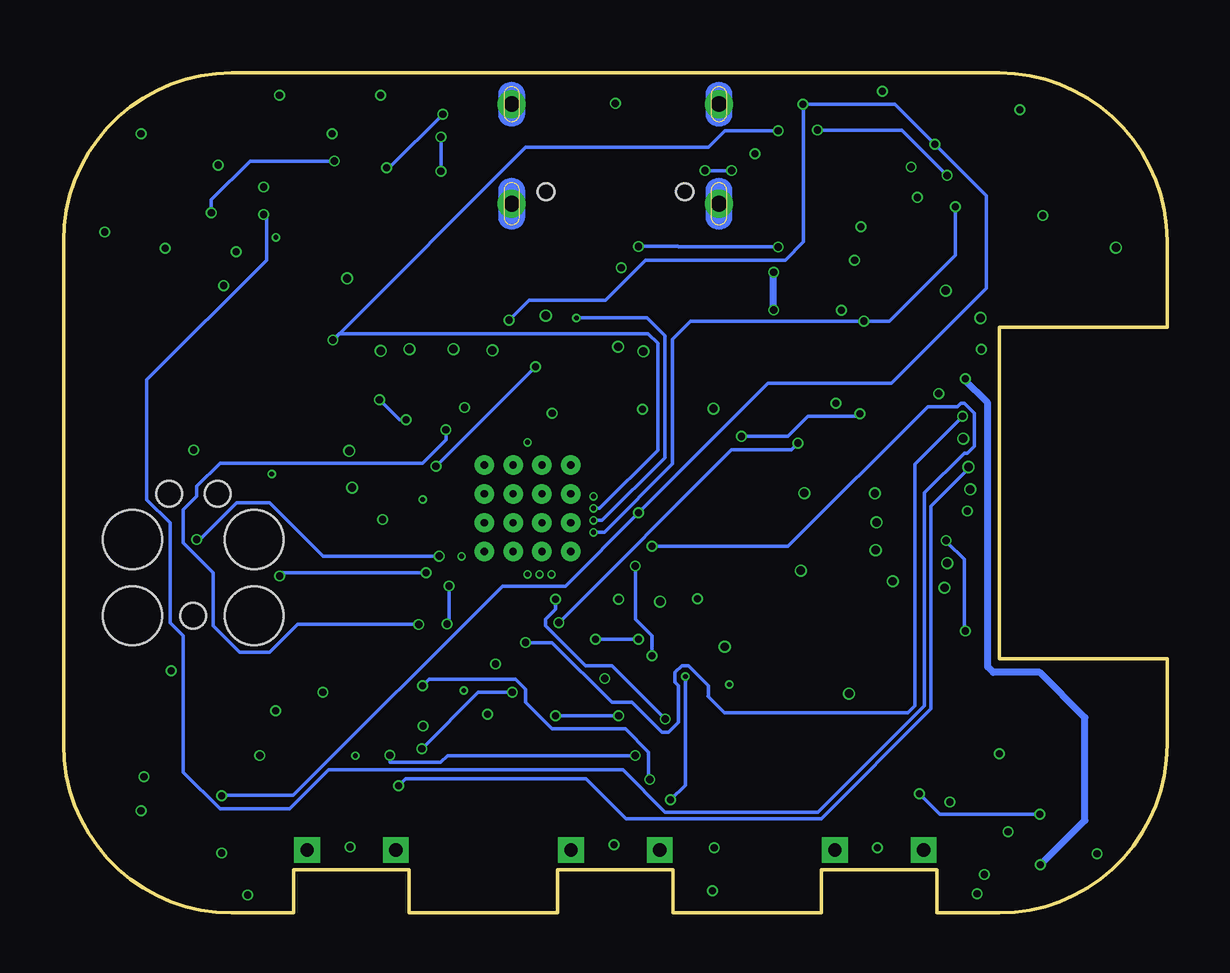
[diagram p4: board, bottom side, seen from below]

Size 46 x 35 mm. Coordinates in mm from the lower left corner, seen from the top.
Outline: 39,0 36.4,0 36.4,1.8 31.6,1.8 31.6,0 25.4,0 25.4,1.8 20.6,1.8 20.6,0 14.4,0 14.4,1.8 9.6,1.8 9.6,0 7,0 arc-90 0,7 0,10.6 7,10.6 7,24.4 0,24.4 0,28 arc-90 7,35 39,35 arc-90 46,28 46,7 arc-90 39,0
Copper layers (1+2*63+16): Top / GND / Bottom / layer 63
Stack-up 4 Layer Stack: Top SilkScreen Epoxy Ink / Top SolderMask User Defined 0.02mm Dk 4.3 / Top Surface Finish Lead-Free 0.02mm / Top User Defined 0.03mm / Dielectric-1 User Defined 0.034mm / Dielectric-2 User Defined 0.034mm / Route2 User Defined 0.03mm / Dielectric-3 User Defined 0.664mm / Route63 User Defined 0.03mm / Dielectric-4 User Defined 0.034mm / Dielectric-5 User Defined 0.034mm / Bottom User Defined 0.03mm / Bottom Surface Finish Lead-Free 0.02mm / Bottom SolderMask User Defined 0.02mm Dk 4.3 / Bottom SilkScreen Epoxy Ink
Design rules: minimum copper width 0.15mm, minimum drill size 0.2mm, copper clearance wire_polygon to wire_polygon 5mil, copper clearance wire_polygon to pad_smd 5mil, copper clearance wire_polygon to via 5mil, copper clearance pad_smd to pad_smd 5mil, copper clearance pad_smd to via 5mil, copper clearance via to via 5mil, copper clearance smd to pad (same net) 5mil, copper clearance smd to via (same net) 5mil, copper clearance smd to smd (same net) 5mil, dimension clearance 0.2mm, via restrict clearance 0mil, restrict clearance 0mil, drill distance 6mil, keepout clearance 0mil

### Footprints (pad centres in the part's own frame; a part is rotated, then mirrored left to right if it is on the bottom)
2450AT18B100E_ANTC3216X140N = smd 1.15 x 1.8: 1 -1.5,0; 2 1.5,0
GRM011R60J152KE01L_2_CAPC0201X13N = smd 0.22 x 0.23: 1 -0.185,0; 2 0.185,0
PERFECT_0402_0402 = smd 0.6 x 0.7: 1 -0.5,0; 2 0.5,0
ESP32_C6_LIBRARY_5_SOD3716X135N = smd 1.15 x 0.8: 1 -1.75,0; 2 1.75,0
ESP32_C6_LIBRARY_3_SOT95P280X145-6N = smd 1.2 x 0.6: 1 -1.25,0.95; 2 -1.25,0; 3 -1.25,-0.95; 4 1.25,-0.95; 5 1.25,0; 6 1.25,0.95
BQ25180YBGR_BGA8C40P2X4_100X155X50 = smd 0.2 x 0.2: A1 -0.2,0.6; A2 0.2,0.6; B1 -0.2,0.2; B2 0.2,0.2; C1 -0.2,-0.2; C2 0.2,-0.2; D1 -0.2,-0.6; D2 0.2,-0.6
DRV2605YZFR_BGA9C50P3X3_144X144X62 = smd 0.25 x 0.25: A1 -0.5,0.5; A2 0,0.5; A3 0.5,0.5; B1 -0.5,0; B2 0,0; B3 0.5,0; C1 -0.5,-0.5; C2 0,-0.5; C3 0.5,-0.5
BMA423_BMA423 = smd 0.3 x 0.35: 1 -0.75,-0.775; 2 -0.25,-0.775; 3 0.25,-0.775; 4 0.75,-0.775; 7 0.75,0.775; 8 0.25,0.775; 9 -0.25,0.775; 10 -0.75,0.775 | smd 0.35 x 0.3: 5 0.775,-0.25; 6 0.775,0.25; 11 -0.775,0.25; 12 -0.775,-0.25
RT6160AWSC_BGA15C40P3X5_140X230X60 = smd 0.216 x 0.216: A1 -0.4,0.8; A2 0,0.8; A3 0.4,0.8; B1 -0.4,0.4; B2 0,0.4; B3 0.4,0.4; C1 -0.4,0; C2 0,0; C3 0.4,0; D1 -0.4,-0.4; D2 0,-0.4; D3 0.4,-0.4; E1 -0.4,-0.8; E2 0,-0.8; E3 0.4,-0.8
503480-2400_5034802400 = smd 0.3 x 0.7: 1 -5.75,1.525; 2 -5.25,1.525; 3 -4.75,1.525; 4 -4.25,1.525; 5 -3.75,1.525; 6 -3.25,1.525; 7 -2.75,1.525; 8 -2.25,1.525; 9 -1.75,1.525; 10 -1.25,1.525; 11 -0.75,1.525; 12 -0.25,1.525; 13 0.25,1.525; 14 0.75,1.525; 15 1.25,1.525; 16 1.75,1.525; 17 2.25,1.525; 18 2.75,1.525; 19 3.25,1.525; 20 3.75,1.525; 21 4.25,1.525; 22 4.75,1.525; 23 5.25,1.525; 24 5.75,1.525 | smd 0.3 x 1: MP1 -6.54,-1.125; MP2 6.54,-1.125
TC2030-IDC_TC2030IDC = smd 0.783 x 0.783: 1 -0.953,-0.635; 2 -0.953,0.635; 3 0.317,-0.635; 4 0.317,0.635; 5 1.588,-0.635; 6 1.588,0.635 | hole 2.451: -2.223,-2.54; -2.223,2.54; 0.952,-2.54; 0.952,2.54 | hole 1.067: -2.223,0; 2.857,-1.016; 2.857,1.016
KH-TYPE-C-16P_KINGHELM_KH-TYPE-C-16P = smd 0.6 x 1.15: A1_B12 -3.2,4.725; A4_B9 -2.4,4.725; A9_B4 2.4,4.725; A12_B1 3.2,4.725 | smd 0.3 x 1.15: A5 -1.25,4.725; A6 -0.25,4.725; A7 0.25,4.725; A8 1.25,4.725; B5 1.75,4.725; B6 0.75,4.725; B7 -0.75,4.725; B8 -1.75,4.725 | drill 0.65 pad 1.05: SH1 -4.32,0; SH2 4.32,0; SH3 -4.32,4.15; SH4 4.32,4.15 | hole 0.7: -2.89,3.65; 2.89,3.65
NORDIC_NRF_2_RESC0201_L = smd 0.28 x 0.43: 1 -0.255,0; 2 0.255,0
ESP32_C6_LIBRARY_2_IND_4828-WE-TPC_WRE = smd 0.9 x 5.3: 1 -2.286,0; 2 2.286,0
MLP2016SR47MT0S1_INDC2016X100N = smd 1.2 x 2.2: 1 -1.028,0; 2 1.028,0
ESP32_C6_LIBRARY_4_ESP32_C6_LIBRARY_4_ESP32_C6_LIBRARY_4_ESP32_C6_LIBRARY_4_ESP32_WROVER_SPARKFUN-DISCRETESEMI_SOT23-3 = smd 0.8 x 0.9: 1 -0.95,-1; 2 0.95,-1; 3 0,1.1
ESP32_C6_LIBRARY_6_SOT65P210X110-3N = smd 1.05 x 0.5: 1 -1.05,0.65; 2 -1.05,-0.65; 3 1.05,0
CPF0201D7K68C1_0201 = smd 0.35 x 0.25: 1 0,0.275; 2 0,-0.275
ESP32_C6_LIBRARY_7_JUMPER_SJ = smd 1.168 x 1.6: 1 -0.762,0; 2 0.762,0
2025-10-22_07-23-44_LIBRARY_SW_EVP-AKE31A_PAN = smd 0.711 x 1.092: 1 -1.4,-0.972; 2 1.4,-0.972 | drill 0.559 pad 0.914 square: 3 -1.848,0.381; 4 1.848,0.381 | smd 1.397 x 1.092: 5 0,-1.124
HECTOR_WATCH_1_TP20R = smd 2 x 2: TP 0,0
NORDIC_NRF_4_AQFN50P700X700X85_HS-74N = smd 4.85 x 4.85: P$74 0,0 | drill 0.3 pad 0.6: P$75 -1.8,1.8; P$76 -0.6,1.8; P$77 0.6,1.8; P$78 1.8,1.8; P$79 -1.8,0.6; P$80 -0.6,0.6; P$81 0.6,0.6; P$82 1.8,0.6; P$83 -1.8,-0.6; P$84 -0.6,-0.6; P$85 0.6,-0.6; P$86 1.8,-0.6; P$87 -1.8,-1.8; P$88 -0.6,-1.8; P$89 0.6,-1.8; P$90 1.8,-1.8 | smd 0.2 x 0.2: P$A8 -1.25,3.25; P$A10 -0.75,3.25; P$A12 -0.25,3.25; P$A14 0.25,3.25; P$A16 0.75,3.25; P$A18 1.25,3.25; P$A20 1.75,3.25; P$A22 2.25,3.25; P$A23 2.75,3.25; P$AA24 3.25,-2.25; P$AB2 -2.75,-2.5; P$AC5 -2,-2.75; P$AC9 -1,-2.75; P$AC11 -0.5,-2.75; P$AC13 0,-2.75; P$AC15 0.5,-2.75; P$AC17 1,-2.75; P$AC19 1.5,-2.75; P$AC21 2,-2.75; P$AC24 3.25,-2.75; P$AD2 -2.75,-3.25; P$AD4 -2.25,-3.25; P$AD6 -1.75,-3.25; P$AD8 -1.25,-3.25; P$AD10 -0.75,-3.25; P$AD12 -0.25,-3.25; P$AD14 0.25,-3.25; P$AD16 0.75,-3.25; P$AD18 1.25,-3.25; P$AD20 1.75,-3.25; P$AD22 2.25,-3.25; P$AD23 2.75,-3.25; P$B1 -3.25,2.75; P$B3 -2.5,2.75; P$B5 -2,2.75; P$B7 -1.5,2.75; P$B9 -1,2.75; P$B11 -0.5,2.75; P$B13 0,2.75; P$B15 0.5,2.75; P$B17 1,2.75; P$B19 1.5,2.75; P$B24 3.25,2.75; P$C1 -3.25,2.25; P$D2 -2.75,2; P$D23 2.75,2; P$E24 3.25,1.75; P$F2 -2.75,1.5; P$F23 2.75,1.5; P$G1 -3.25,1.25; P$H2 -2.75,1; P$H23 2.75,1; P$J1 -3.25,0.75; P$J24 3.25,0.75; P$K2 -2.75,0.5; P$L1 -3.25,0.25; P$L24 3.25,0.25; P$M2 -2.75,0; P$N1 -3.25,-0.25; P$N24 3.25,-0.25; P$P2 -2.75,-0.5; P$P23 2.75,-0.5; P$R1 -3.25,-0.75; P$R24 3.25,-0.75; P$T2 -2.75,-1; P$T23 2.75,-1; P$U1 -3.25,-1.25; P$U24 3.25,-1.25; P$V23 2.75,-1.5; P$W1 -3.25,-1.75; P$W24 3.25,-1.75; P$Y2 -2.75,-2; P$Y23 2.75,-2
ESP32_C6_LIBRARY_SON50P200X200X80-9N = smd 0.76 x 0.27: 1 -0.985,0.75; 2 -0.985,0.25; 3 -0.985,-0.25; 4 -0.985,-0.75; 5 0.985,-0.75; 6 0.985,-0.25; 7 0.985,0.25; 8 0.985,0.75 | smd 0.9 x 1.3: 9 0,0
NORDIC_NRF_BT-XTAL_2016_N = smd 0.95 x 0.85: 1 -0.725,-0.575; 2 0.725,-0.575; 3 0.725,0.575; 4 -0.725,0.575
NORDIC_NRF_1_XTAL_3215_N = smd 1 x 1.8: 1 -1.25,0; 2 1.25,0

### Placement (x,y rotation side)
ANT1  28.21,1.69 180 top
C1  32.78,22.11 90 top
C1_EP-DR  6.99,8.04 270 top
C2  31.58,22.29 90 top
C2-EP-DR  7.39,4.75 180 top
C3  31.81,18.81 180 top
C4  29.58,6.98 180 top
C5  20.07,21.01 0 top
C6  22.92,22.25 90 top
C7  27.24,11.45 90 top
C8  21.84,22.35 270 top
C9  31.99,16.41 180 top
C10  25.9,23.91 270 top
C11  31.99,20.03 180 top
C12  29.3,22.11 270 top
C13  28.14,22.16 270 top
C14  28.93,11.56 270 top
C15  27.07,22.26 270 top
C16  25.88,22.24 90 top
C17  20.38,19.7 0 top
C18  20.11,13.79 90 top
C19  42.96,31.46 90 top
C20  24.62,11.6 270 top
C21  22.77,11.72 270 top
C22  29.56,7.99 180 top
C23  29.01,32.15 90 top
C24  35.98,30.22 180 top
C25  29.03,33.83 90 top
C27  9.82,33.8 90 top
C29  37.06,1.08 270 top
C30  8.97,1.08 270 top
C31  19.97,1.08 270 top
C32  39.24,7.83 180 top
C33  34.93,34.05 0 top
C34  41.71,5.05 270 top
C37  7.63,33.59 270 top
C38  4.03,26.27 90 top
C39  4.04,28.99 270 top
C42  29,30.8 270 top
C43  28.99,28.98 270 top
D2  16.05,7.22 180 top
D3  12.78,28.57 180 top
D4  16.78,2.72 90 top
D5  10.5,7.2 180 top
EPD_C1  13.17,22.42 180 top
EPD_C2  13.08,23.49 180 top
EPD_C5  13.38,19.85 180 top
EPD_C6  13.63,18.49 180 top
EPD_C7  13.65,16.95 180 top
EPD_C8  13.67,15.46 180 top
EPD_C9  13.11,13.53 180 top
EPD_C10  13.11,12.36 180 top
EPD_C11  13.11,11.27 180 top
EPD_C12  13.14,10.1 180 top
IC1  6.31,30.5 180 top
IC2  39.41,4.88 0 top
IC3  39.86,29.15 180 top
IC9  31.41,32.74 180 top
J1  9.1,17.5 270 top
J2  40.59,14.61 90 top
J4  23,33.7 180 top
L1  31.91,17.72 0 top
L2  23.98,22.3 90 top
L3  24.94,22.27 270 top
L5  3.35,7.65 0 top
L7  32.05,29.13 0 top
Q1  15.74,10.5 90 top
Q3  6.64,2.33 270 top
R1_EP_DR  8.96,3.39 0 top
R1_USB  23.74,26.84 90 top
R2  33.99,32.97 90 top
R2_EP_DR  8.27,3.64 0 top
R2_USB  21.52,26.86 90 top
R3  42.92,29.76 0 top
R4  32.74,32.7 90 top
R5  8.83,2.4 270 top
R7  37.04,2.4 90 top
R8  19.99,2.74 270 top
R9  6.3,32.72 270 top
R17  34,32.17 270 top
R18  34.47,27.21 180 top
R_PWR_EPD  16.76,10.49 180 top
R_TYPE_SEL  4.25,2.14 90 top
SJ1  3.47,3.67 0 top
SW_DN  34,3 180 top
SW_ENT  23,3 180 top
SW_UP  12,3 180 top
TP_3.3V  27.72,6.84 0 top
TP_3V3  41.41,25.9 0 top
TP_BAT_GND  1.88,30.02 0 top
TP_GND  44.15,25.83 0 top
TP_ON  42.06,2.59 0 top
TP_OP  42.88,7.82 0 top
TP_RESET  38.31,22.12 0 top
TP_SCL  36.98,25.82 0 top
TP_SDA  40.35,33.54 0 top
TP_SWDCLK  41.05,22.11 0 top
TP_SWDIO  43.97,22.16 0 top
TP_SWO  32.26,14.01 0 top
TP_VBAT  3.48,32.17 0 top
TP_VREG  36.53,31.86 0 top
U1  26.66,16.86 0 top
U3  12.83,32.63 0 top
X1  24.24,6.17 0 top
X2  20.1,16.6 90 top

### Tracks (layer width: path | path; a pad name or v marks a point on that pad's centre or on a via)
3V3  (via drill 0.3, 0.35)
  Top 0.15: IC2.C2 v39.41,2.5 | C34.2 42.16,4.87 v42.77,4.26 | v32.78,34.07 32.45,34.07 32.03,34.49 31.49,34.49 31.41,34.41 IC9.E2 IC9.E3 30.67,33.88 30.14,33.88 | C19.2 42.96,32.27 v42.77,32.46 | R17.1 34.53,32.17 34.8,32.44 v34.8,32.46 | C7.2 27.24,12.51 27.29,12.51 | 22.95,20.87 23.41,20.41 U1.P$B1 | 27.29,12.51 28.51,12.51 C14.1 | U1.P$Y2 23.66,14.86 U1.P$W1 23.41,14.9 21.48,12.97 v21.13,12.97 | Q1.2 16.76,11.43 R_PWR_EPD.2 | 27.29,12.51 26.88,12.93 26.88,13.62 U1.P$AD14 | v29.93,13.62 29.51,13.62 U1.P$AD23 | U1.P$A22 28.91,20.68 v29.29,21.06 v29.3,21.07 C12.2 | R18.1 34.47,26.73 v34.18,26.44 | v21.87,20.99 21.87,22.13 C8.2 22.25,21.75 C6.1
  Top 0.3: R7.2 39.31,2.4 v39.41,2.5 | J2.1 41.51,13.37 v41.51,10.09 | v39.55,31.16 39.55,29.98 IC3.3 | IC3.10 41.09,28.38 v41.76,27.7 41.76,26.25 TP_3V3.TP | IC3.7 39.11,27.85 v38.81,27.55 | C33.1 32.8,34.05 v32.78,34.07 | 30.14,33.88 30.02,33.76 29.46,33.76 C25.1 | R5.2 7.75,1.6 v7.62,1.6 | C6.1 22.92,20.9 22.95,20.87 | C14.1 29.99,12.06 v30.01,12.04 | v28.32,8.28 28.32,7.44 TP_3.3V.TP | Q1.2 18.08,11.45 v18.44,11.09 19.27,10.26 19.27,9.04 19.67,8.64 21.17,8.64 21.59,8.22 21.59,6.39 19.72,4.52 R8.2 19.69,2.71 v18.88,2.71
  Bottom 0.15: v29.93,13.62 29.93,12.1 v30.01,12.04
  pour 3V3 (isolate 0.254): -3.49,-4.42 51.3,-4.42 51.3,37.8 -3.49,37.8
ALERT  (via drill 0.2, 0.3)
  Top 0.15: v31.03,17.22 30.76,17.22 30.34,17.64 29.93,17.64 U1.P$J24 | v17.18,31.63 14,31.63 13.86,31.77 U3.5
  3V3 0.15: v31.03,17.22 33.65,19.84 33.65,24.33 30.51,27.47 24.63,27.47 23.59,28.51 23.59,30.66 22.62,31.63 v17.18,31.63
D+  (via drill 0.3)
  Top 0.15: v25.35,12.1 25.35,12.38 24.94,12.79 24.94,13.62 U1.P$AD6
  Top 0.3: D3.4 11.24,29.81 v10.4,29.81
  GND 0.15: v15.38,19.58 12.75,19.58 10.4,21.92 v10.4,29.81
  Bottom 0.15: v25.35,12.1 18.15,19.3 15.66,19.3 v15.38,19.58
D-  (via drill 0.3)
  Top 0.15: v13.03,27.2 12.06,27.2 11.64,27.61 D3.6 | v23.83,11.41 23.83,12.38 24.39,12.93 24.39,13.62 U1.P$AD4 | v22.03,11.41 19.54,11.41 15.94,15.01 15.94,22.76 v13.58,25.12
  Bottom 0.15: v22.03,11.41 v23.83,11.41
  3V3 0.15: v13.58,25.12 13.58,26.64 v13.03,27.2
DN  (via drill 0.3)
  Top 0.15: v16.21,27.75 14.14,27.75 D3.1 | J4.A7 22.75,27.99 22.86,27.88 | 22.86,27.88 22.98,27.76 23.43,27.76 23.75,28.08 J4.B7 | 22.86,27.88 22.14,27.88 v22.03,27.77
  Bottom 0.15: v16.21,27.75 20.37,27.75 20.39,27.77 v22.03,27.77
DP  (via drill 0.3)
  Top 0.15: v19.26,30.93 21.32,30.93 22.29,29.98 | 14.14,29.55 D3.3 | J4.A6 23.25,30 23.2,30.05 22.36,30.05 22.29,29.98 | J4.B6 22.25,29.94 22.29,29.98
  Top 0.3: v18.15,30.93 15.52,30.93 14.14,29.55
  Bottom 0.15: v18.15,30.93 v19.26,30.93
EPD_3V3
  Top 0.15: 12.33,19.85 EPD_C5.2
  Top 0.3: L5.2 6.52,8.54 C1_EP-DR.1 9,10.55 9,12.25 7.82,13.43 7.82,15.88 8.13,16.19 10.56,16.19 J1.15 | J1.15 J1.16 11.04,15.75 11.43,15.36 11.43,14.89 12.01,14.31 14.57,14.31 14.64,14.24 Q1.3 | J1.15 11.19,16.25 11.6,16.66 11.6,19.12 12.33,19.85
EPD_BUSY  (via drill 0.3)
  Top 0.15: v8.52,20.7 9.99,19.23 10.61,19.23 J1.9 | v26.74,11.27 26.46,11.54 26.46,13.62 U1.P$AD12
  Bottom 0.15: v8.52,20.7 10.52,18.7 10.52,8.63 10.81,8.34 18.46,8.34 19.15,9.03 19.12,9.05 19.12,9.47 19.95,10.3 20.23,10.3 20.51,10.02 20.51,9.61 20.37,9.47 20.37,7.94 20.78,7.53 21.06,7.53 22.31,8.77 23.14,8.77 25.63,11.27 v26.74,11.27
EPD_CS  (via drill 0.2, 0.35)
  Top 0.15: J1.12 10.53,17.65 v8.21,17.65
  GND 0.15: v8.21,17.65 10.98,17.65 11.99,18.66 14.87,18.66 16.17,17.36 U1.P$K2
  other vias: 23.91,17.36
EPD_DC  (via drill 0.3, 0.35)
  Top 0.15: v27.29,9.19 26.19,10.3 26.19,13.07 25.91,13.34 25.91,13.62 U1.P$AD10 | v31.06,6.84 31.06,6.27 v32.04,5.29
  Top 0.3: J1.11 8.61,18.25 v8.28,18.58
  Bottom 0.15: v31.06,6.84 28.71,9.19 v27.29,9.19 | v32.04,5.29 31.74,5.59 24.23,5.59 22.56,3.93 14.41,3.93 9.84,8.5 9.84,16.95 8.32,18.47 v8.28,18.58
EPD_RST  (via drill 0.2, 0.35)
  Top 0.3: J1.10 9.51,18.75 v8.5,19.76
  3V3 0.15: U1.P$AC11 26.16,9.81
  3V3 0.3: v8.5,19.76 8.08,19.76 7.44,19.12 7.44,9.97 11.35,6.06 18.25,6.06 19.51,7.32 23.67,7.32 26.16,9.81
  other vias: 26.16,14.11
GDR  (via drill 0.3)
  Top 0.3: R2_EP_DR.2 8.26,3.38 Q3.1 v6.63,3.38 | v7.74,23.48 8.08,23.48 8.8,22.76 J1.2
  GND 0.3: v6.63,3.38 6.07,3.94 6.07,8.86 6.65,9.44 9.7,9.44 9.7,11.96 9.2,12.46 8.6,12.46 7.51,13.55 7.51,20.48 7.74,20.71 v7.74,23.48
GND  (via drill 0.3, 0.35)
  Top 0.15: v2.92,2.47 3.25,2.14 R_TYPE_SEL.1 | R9.2 6.02,31.19 IC1.D2 | 9.31,33.61 C27.1 | C22.1 30.81,7.99 v31.01,7.79 30.2,6.98 C4.1 | v42.65,5.68 42.2,5.23 C34.1 40.27,5.23 IC2.B3 | 43.89,31.27 C19.1 | IC9.B1 IC9.C1 IC9.C2 IC9.C3 30.92,32.83 29.5,32.83 C23.2 27.84,32.34 27.32,31.81 | C42.1 27.82,30.98 27.32,31.48 | EPD_C5.1 13.56,21 v13.8,21.24 | 28.54,18.61 28.82,18.33 29.37,18.33 U1.P$F23 | v32.7,16.39 32.28,16.39 C9.1 | 37.27,6.42 38.79,4.9 IC2.B1 | v22.75,26.88 22.75,26.92 | 28.54,18.61 U1.P$74 | 28.54,18.61 U1.P$78 | C18.1 19.59,13.09 v19.58,13.09 | C7.1 27.99,10.52 v27.99,10.37 | X1.4 24.02,6.24 24.21,6.24 24.8,5.64 24.8,5.6 | v22.88,23.59 22.88,22.79 C6.2 | v21.83,23.4 v21.84,23.39 C8.1 | C5.1 v18.91,21.01 18.91,20.98 C17.1 | C2.2 v31.58,23.49 | C1.2 v32.78,23.42 | C3.1 32.88,18.81 v33.97,17.72 | C13.1 28.12,22.37 v28.12,23.44 | C12.1 29.75,22.75 v29.75,23.49 | C10.1 v25.9,24.89 | C11.1 33.31,20.03 v34.09,19.25
  Top 0.3: C31.2 19.06,0.58 18.95,0.69 v18.95,0.93 18.91,0.97 D4.1 | C30.2 8.14,0.58 v7.92,0.8 | SJ1.1 2.92,3.46 v2.92,2.47 | J1.8 9.98,19.75 9.52,20.21 v9.52,21.64 | EPD_C9.1 EPD_C10.1 EPD_C11.1 13.64,11.24 EPD_C12.1 13.64,9.52 v13.26,9.14 | EPD_C2.1 13.58,22.51 EPD_C1.1 13.8,22.29 v13.8,21.24 | 9.31,33.61 8.79,33.09 C37.2 7.25,33.47 v6.14,33.47 6.02,33.36 R9.2 | U3.4 11.04,31.08 v10.67,31.08 | J4.SH1 27.32,31.81 27.32,31.48 J4.SH3 | 22.97,33.7 J4.SH2 J4.SH4 19.25,28.98 J4.A12_B1 | 22.97,33.7 v23,33.73 | J4.SH1 22.97,33.7 | v8.41,11.75 8.41,11.39 J1.MP2 | SW_UP.1 12.98,3.55 12.98,3.17 12.53,2.72 v12.07,2.72 | v23.06,2.84 23.82,2.84 24.01,3.03 24.01,3.58 SW_ENT.1 24.96,4.54 X1.2 24.8,5.6 | SW_DN.1 34.98,3.55 34.98,2.75 v34.05,2.75 | C29.2 38.16,0.58 v38.33,0.75 | J2.3 J2.5 40.58,16.84 v40.58,19.29 | C32.2 37.76,7.83 37.73,7.86 | 37.73,7.86 v37.16,8.43 | J4.A1_B12 26.77,29.55 J4.SH3 | C1_EP-DR.2 v6.99,6.63 | IC3.9 IC3.8 39.61,26.43 v39.32,26.14 | TP_GND.TP 44.28,25.96 v44.28,28.37 | R3.2 43.16,29.48 v44.28,28.37 | 43.89,31.27 44.28,30.89 v44.28,28.37 | C21.2 22.77,10.43 v23.43,9.77 | v23.43,9.77 v23.44,9.77 | C20.2 24.62,10.96 v23.43,9.77 | X1.4 23.52,9.68 v23.43,9.77 | C43.2 28.39,28.48 J4.SH3 | C25.2 27.95,34.33 J4.SH1 | C33.2 36.98,34.05 v37,34.07 | D3.2 12.77,28.57 v12.76,28.58 v12.76,28.59 | U3.1 11.85,34.23 v11.86,34.24 v11.87,34.24 12.83,33.28 U3.9 13.08,32.38 U3.6 | C24.1 36.51,30.25 v37.66,30.25 | R2_EP_DR.1 8.35,3.91 v9.05,4.62 | 37.27,6.42 37.27,7.39 37.73,7.86 | R2_USB.2 21.86,26.92 22.75,26.92 | R1_USB.1 22.8,26.84 v22.75,26.88 | J1.17 9.48,15.25 v9.21,15.52 | EPD_C8.1 14.17,15.36 v15.27,14.26 | C14.2 28.24,10.37 v27.99,10.37
  Top 0.3: EPD_C7.1 14.58,16.95 v15.12,17.49 v15.12,17.5 EPD_C6.1 | C38.2 3.08,26.77 v2.13,27.72 | v2.13,27.72 2.9,28.49 C39.2 | J1.MP1 7.78,24.23 v7.78,24.79 | TP_BAT_GND.TP 2.13,29.77 v2.13,27.72
  Bottom 0.15: v8.41,11.75 8.46,11.82 8.46,14.73 9.15,15.42 v9.21,15.52
  pour GND (isolate 0.254): -4.64,-5.41 -4.64,39.16 53.1,39.16 53.1,-5.41
HAPTIC_EN  (via drill 0.3)
  Top 0.15: v37.82,6.56 38.93,5.45 IC2.A1 | v22.17,14.45 22.31,14.45 23.41,15.56 U1.P$U1 | v21.48,10.71 21.48,8.88 22.17,8.18 v22.17,6.56 | v35.19,9.19 35.02,9.19 v32.4,6.57
  GND 0.15: v37.82,6.56 v35.19,9.19
  Bottom 0.15: v22.17,14.45 22.17,12.24 21.48,11.54 v21.48,10.71 | v22.17,6.56 30,6.56 30.28,6.29 32.4,6.29 v32.4,6.57
IMU_INT1  (via drill 0.3)
  Top 0.15: v37.65,29.1 38.62,29.1 38.79,29.27 39.07,29.27 IC3.5 | v21.48,15.28 22.72,16.53 23.41,16.53 U1.P$N1
  Bottom 0.15: v21.48,15.28 15.8,15.28 9.98,21.1 8.73,21.1 8.6,21.24 8.46,21.24 8.04,20.82 8.04,19.44 8.32,19.16 8.46,19.16 10.12,17.5 10.12,8.64 14.55,4.2 20.92,4.2 22.68,5.96 34.96,5.96 36.57,4.34 39.48,4.34 41,5.87 41,11.54 41.56,12.1 41.56,16.25 42.53,17.22 42.53,22.21 37.54,27.2 37.54,28.99 v37.65,29.1
IMU_INT2  (via drill 0.2)
  Top 0.15: IC3.6 38.95,28.76 38.3,28.76 37.69,28.15 v37.15,28.15
  GND 0.15: v24.62,24.79 25.34,25.51 34.51,25.51 v37.15,28.15
  Bottom 0.15: U1.P$P2 23.55,16.36 20.94,18.97 20.94,24.05 21.68,24.79 v24.62,24.79
  other vias: 23.91,16.36
LX1  (via drill 0.3)
  Top 0.15: IC9.B2 IC9.B3 v30.27,32.34 v30.27,32.33 | v30.27,30.9 31.02,30.15 L7.1
  Bottom 0.15: v30.27,32.33 v30.27,30.9
LX2  (via drill 0.3)
  Top 0.15: IC9.D2 IC9.D3 30.33,33.14 v30.19,33.28 | v32.54,31.05 33.08,30.51 L7.2
  Bottom 0.15: v30.19,33.28 32.42,31.05 v32.54,31.05
MOSI  (via drill 0.2, 0.3)
  Top 0.15: J1.14 v8.32,16.75
  3V3 0.15: U1.P$B13 26.66,21.09 26.22,21.53 23.88,21.53 22.55,20.2 21.86,20.2 19.38,22.68 16.55,22.68 14.61,20.74 14.61,18.35 12.18,18.35 10.66,16.83 8.4,16.83 v8.32,16.75
  other vias: 26.66,19.61
N$1
  Top 0.15: IC9.D1 32.03,33.14 R4.1
N$2
  Top 0.15: IC9.E1 33.15,33.54 R2.1
N$3  (via drill 0.3)
  Top 0.15: v22.86,13.07 23.83,14.04 24.66,14.04 U1.P$AC5 | v25.49,8.22 25.49,11.27 24.66,12.1 C20.1
  Bottom 0.15: v25.49,8.22 v22.86,8.22
  3V3 0.15: v22.86,8.22 v22.86,13.07
N$4
  Top 0.15: U1.P$C1 23.41,19.16 22.03,19.16 20.23,20.96 C5.2
N$5
  Top 0.15: IC3.1 42.81,29.93 R3.1
N$6
  Top 0.15: R9.1 6.57,31.16 IC1.D1
N$7
  Top 0.15: 21.2,18.89 20.54,19.54 C17.2 | 21.2,18.89 21.34,18.75 23.55,18.75 23.69,18.89 23.83,18.89 U1.P$D2 | 21.2,18.89 20.23,17.91 X2.2
N$8
  Top 0.15: L2.2 24.11,22.62 24.94,22.62 L3.1
N$9
  Top 0.15: U1.P$B3 24.11,19.58 24.11,21.93 L2.1
N$11
  Top 0.15: U1.P$F2 23.83,18.33 23.69,18.33 23.55,18.47 22.59,18.47 20.23,16.11 20.23,15.42 X2.1 20.09,15.28 20.09,14.04 C18.2
N$12
  Top 0.15: U1.P$B7 25.08,19.58 25.08,21.38 25.77,22.07 C16.1 25.91,22.07 26.19,21.79 27.02,21.79 C15.2
N$15
  Top 0.15: U1.P$D23 29.51,18.89 29.79,19.16 30.89,19.16 31.73,19.99 C11.2
N$16  (via drill 0.3)
  Top 0.15: 29.79,20.41 31.45,22.07 31.59,22.07 C2.1 | 29.79,20.41 29.51,20.13 U1.P$A23 | 29.79,20.41 v30.06,20.13 | v31.19,12.02 31.09,12.02 25.91,6.84 25.08,6.84 X1.3
  Bottom 0.15: v31.19,12.02 36.24,12.02 37.4,10.85 38.65,10.85 39.76,11.96 39.76,14.18 41,15.42 41,16.81 40.45,17.36 40.45,17.78 39.48,18.75 31.03,18.75 30.06,19.72 v30.06,20.13
N$17  (via drill 0.3)
  Top 0.15: v31.73,20.55 30.76,19.58 29.93,19.58 U1.P$B24 | C1.1 32.83,21.93 v32.83,21.38 34.63,19.58 34.63,12.79 31.31,9.47 v31.03,9.47 | X1.1 23.48,5.56 v21.57,5.56
  Bottom 0.15: v31.73,20.55 32,20.55 v32.83,21.38 | v21.57,5.56 21.61,5.61 21.61,6.7 22.59,7.67 25.63,7.67 26.74,8.77 26.74,9.33 27.16,9.74 30.76,9.74 v31.03,9.47
N$19
  Top 0.15: U1.P$H23 29.61,18.06 30.39,18.06 30.73,17.72 L1.1 31.62,17.75 C3.2
N$20
  Top 0.15: L1.2 33.14,17.72 34.35,16.51 34.35,13.03 33.72,12.4 33.31,12.4 29.38,8.46 C22.2 29.38,7 C4.2 29.39,4.01 29.71,3.69 ANT1.1
N$22  (via drill 0.35)
  Top 0.15: v9.16,14.57 9.32,14.73 10.54,14.73 J1.18 | EPD_C6.2 12.18,17.54 v12.18,17.48
  GND 0.15: v9.16,14.57 12.07,17.48 v12.18,17.48
N$23  (via drill 0.35)
  Top 0.15: J1.19 9.98,14.25 v9.28,13.55 | EPD_C7.2 12.47,16.27 v12.11,16.27
  GND 0.15: v9.28,13.55 12,16.27 v12.11,16.27
N$24
  Top 0.15: U1.P$A18 27.99,20.13 27.99,21.79 28.12,21.93 C13.2
N$25
  Top 0.15: U1.P$N24 29.93,16.53 31.59,16.53 31.73,16.39 C9.2
N$26  (via drill 0.35)
  Top 0.15: v11.44,13.82 10.95,13.82 J1.20 | v12.15,15.12 12.49,15.46 EPD_C8.2
  GND 0.15: v11.44,13.82 11.44,14.42 v12.14,15.12 v12.15,15.12
N$27
  Top 0.3: J4.B5 R2_USB.1
N$28
  Top 0.3: EPD_C10.2 12.22,12.75 J1.22
N$30
  Top 0.3: J1.4 11.31,21.75 11.65,22.09 11.65,23.02 12.12,23.49 EPD_C2.2
N$31
  Top 0.3: J1.5 11.5,21.25 EPD_C1.2
N$32
  Top 0.3: EPD_C12.2 12.62,10.12 12.26,10.12 J1.24
N$33  (via drill 0.3)
  Top 0.15: v10.33,4.97 9.03,3.66 R1_EP_DR.1
  Top 0.3: R_TYPE_SEL.2 4.52,3.38 SJ1.2 4.86,3.67 v5.3,4.11
  Bottom 0.15: v5.3,4.11 9.47,4.11 v10.33,4.97
N$34
  Top 0.15: C2-EP-DR.2 3.97,4.75 | L5.1 3.97,4.75 | Q3.3 3.98,1.28 3.4,1.86 2.79,1.86 1.87,2.78 1.87,3.32 1.05,4.14 1.05,4.53 1.23,4.71 3.93,4.71 3.97,4.75
  Top 0.3: C2-EP-DR.2 6.89,5.34 D5.2
N$35  (via drill 0.3)
  Top 0.15: U1.P$B5 24.66,19.58 24.66,21.66 24.94,21.93 L3.2 25.08,22.07 25.35,22.07 25.77,22.49 C16.2 25.91,22.49 | 25.91,22.49 26.05,22.49 v26.32,22.76 27.02,22.76 C15.1 | 25.91,22.49 C10.2 | v30.48,18.61 29.93,18.61 U1.P$E24
  Bottom 0.15: v26.32,22.76 v30.48,18.61
N$37
  Top 0.3: R1_USB.2 24.02,27.76 24.25,27.99 J4.A5
N$39
  Top 0.3: C2-EP-DR.1 8.85,5.71 15.54,5.71 D4.2 17.8,5.49 D2.1
N$43
  Top 0.15: IC2.A2 39.41,6.61 39.67,6.87
  Top 0.3: 39.67,6.87 39.74,6.94 C32.1
OUT+
  Top 0.15: IC2.A3 42.35,7.82 TP_OP.TP
OUT-
  Top 0.15: IC2.C3 40.27,4.38 TP_ON.TP
P0.13  (via drill 0.3)
  Top 0.15: C30.1 8.97,2.27 R5.1 9.38,2.68 9.38,3.41 9.94,3.97 SW_UP.2 | v20.92,8.08 20.65,7.8 20.51,7.75 | v25.49,13.07 25.49,13.62 U1.P$AD8
  Top 0.3: SW_UP.2 10.6,4.51 11.24,5.15 14.07,5.15 16.19,3.03 17.48,3.03 20.51,6.06 20.51,7.75
  Bottom 0.15: v25.49,13.07 25.49,12.65 25.91,12.24 25.91,11.96 24.25,10.3 23.14,10.3 v20.92,8.08
P0.14  (via drill 0.2, 0.3)
  Top 0.15: SW_ENT.2 21.44,3.97 v20.7,4.71
  Top 0.3: C31.1 19.97,1.94 20.27,2.24 R8.1 20.27,3.58 20.66,3.97 SW_ENT.2
  GND 0.15: U1.P$AC9 21.4,9.85 v20.08,9.85
  Bottom 0.15: v20.08,9.85 20.08,5.33 v20.7,4.71
  other vias: 25.66,14.11
P1.01  (via drill 0.2)
  Top 0.15: R_PWR_EPD.1 16.74,10.2 Q1.1 16.77,9.52 v18.25,9.52
  GND 0.15: U1.P$Y23 23.39,8.84 18.87,8.84 18.22,9.49 v18.25,9.52
  other vias: 29.41,14.86
P1.02  (via drill 0.2)
  Top 0.15: 34.89,5.02 35.59,5.02 36.77,3.84 R7.1 36.85,2.27 36.99,2.13 36.99,1.71 C29.1 | 34.89,5.02 33.08,5.02 32.6,4.54 SW_DN.2 | v29.32,9.27 33.8,13.75 33.8,14.45 32.83,15.42 30.2,15.42 29.93,15.15 U1.P$W24 | 34.89,5.02 34.37,5.54 34.37,6.02 v33.84,6.55
  GND 0.15: v33.84,6.55 31.88,8.51 30.07,8.51 v29.32,9.27
PMIC_INT  (via drill 0.2, 0.3)
  Top 0.15: IC1.A1 6.98,29.43 v8.83,29.43
  Bottom 0.15: v8.83,29.43 8.83,27.4 11.57,24.66 v12.64,24.66 19.86,24.66 20.61,23.91 20.61,18.71 23.46,15.86 U1.P$T2
  other vias: 23.91,15.86
PREVGH
  Top 0.3: EPD_C9.2 12.33,13.25 J1.21 10.12,13.25 9.45,12.58 9.45,9.99 D5.1
PREVGL
  Top 0.3: EPD_C11.2 11.63,12.25 J1.23 10.17,12.25 9.89,11.97 9.89,10.42 12.25,8.06 13.46,8.06 D2.2
RESE  (via drill 0.3)
  Top 0.15: 8.07,2.62 8.27,2.82 8.96,2.82 R1_EP_DR.2
  Top 0.3: 8.07,2.62 7.55,2.1 6.67,2.1 5.99,2.78 Q3.2 5.28,2.67 v5.28,2.01 | J1.3 v8.41,22.26
  Bottom 0.3: v5.28,2.01 3.43,3.86 3.43,8.14 5.31,10.02 7.25,10.02 7.48,10.25 7.48,21.25 8.45,22.22 v8.41,22.26
RESET  (via drill 0.2)
  Top 0.15: J2.6 39.65,16.2 38.26,17.59 38.26,18.34 | TP_RESET.TP 38.31,18.39 38.26,18.34 | v37.32,18.29 38.21,18.29 38.26,18.34
  3V3 0.15: U1.P$AC13 27.87,12.9 35.04,12.9 36.34,14.2 36.34,17.69 36.94,18.29 v37.32,18.29
  other vias: 26.66,14.11
SCK  (via drill 0.3)
  Top 0.15: v25.63,20.82 26.32,20.13 U1.P$A12 | v12.8,20.8 12.73,20.8 11.23,19.3 11.23,17.5 11.09,17.36 10.67,17.36 J1.13
  Bottom 0.15: v17.74,19.85 15.8,19.85 14.97,20.69 12.89,20.69 v12.8,20.8
  3V3 0.15: v25.63,20.82 23.69,20.82 22.72,19.85 v17.74,19.85
SCL  (via drill 0.2, 0.3)
  Top 0.15: R4.2 33.19,32.7 R17.2 33.94,31.95 33.94,31.61 34.22,31.33 v34.71,31.33 | IC1.B1 8.74,30.3 v9.17,30.73 | U3.7 14.32,32.88 v14.58,32.62 14.58,32.6 v16.21,32.6 | IC2.C1 37.69,4.38 36.61,5.46 36.61,8.32 35.74,9.19 35.74,22.62 35.88,22.76 | 37.82,24.7 37.22,25.3 TP_SCL.TP | 37.82,24.7 37.96,24.56 41.84,24.56 42.67,25.39 42.67,28.58 41.97,29.27 40.73,29.27 IC3.12 40.06,29.4 v39.84,29.18 | 37.82,24.7 35.88,22.76 | 35.88,22.76 v34.77,23.87
  Bottom 0.15: v9.17,30.73 11.06,32.62 v14.58,32.62 | v16.21,32.6 18.43,32.6 19.12,31.9 26.74,31.9 v34.77,23.87 34.51,24.13 21.63,24.13 21.23,23.73 21.23,19.28 23.65,16.86 U1.P$M2 | v39.84,29.18 39.84,29.72 38.23,31.33 v34.71,31.33
  other vias: 23.91,16.86
SDA  (via drill 0.3)
  Top 0.15: R2.2 35.3,32.97 35.57,33.24 40.05,33.24 TP_SDA.TP | v9.68,32.03 7.73,32.03 7.38,31.68 7.38,31.11 6.97,30.7 IC1.C1 | v15.18,33.7 14.86,33.38 U3.8 | 40.11,31.63 39.34,31.63 39.07,31.35 39.07,30.93 37.82,29.69 37.27,29.69 35.05,27.47 34.49,27.47 R18.2 34.36,27.47 32.2,25.31 28.04,25.31 v27.43,24.7 | v22.03,16.67 22.45,17.09 23.41,17.09 U1.P$L1
  Top 0.3: IC3.2 40.11,31.63 40.11,33.3 TP_SDA.TP
  Bottom 0.15: v27.43,24.7 26.6,25.53 23.41,25.53 21.74,27.2 15.91,27.2 15.15,27.97 15.15,33.67 v15.18,33.7 11.35,33.7 v9.68,32.03 7.53,29.88 7.53,26.03 11.49,22.07 16.63,22.07 v22.03,16.67 25.08,13.62 27.71,13.62 36.43,4.9 39.34,4.9 IC2.B2
  other vias: 39.41,4.88
SWDCLK  (via drill 0.3)
  Top 0.15: TP_SWDCLK.TP 41.4,21.76 41.4,19.3 42.7,18 43.86,18 44.95,16.91 44.95,14.32 44.59,13.96 42.25,13.96 41.91,14.3 40.58,14.3 J2.4 40.45,15.42 v40.45,15.56 | v30.34,14.87 30.2,14.87 29.93,14.59 U1.P$AA24
  Bottom 0.15: v30.34,14.87 35.19,14.87 37.4,17.09 38.79,17.09 40.31,15.56 v40.45,15.56
SWDIO  (via drill 0.3)
  Top 0.15: TP_SWDIO.TP 45.29,20.84 45.29,9.84 44.79,9.34 40.1,9.34 39.65,9.79 39.65,12.75 39.95,13.05 J2.2 39.9,13.76 39.62,14.04 v36.99,14.04 | v30.89,14.18 29.93,14.18 U1.P$AC24
  Bottom 0.15: v30.89,14.18 36.85,14.18 v36.99,14.04
SWO
  Top 0.15: U1.P$AD22 28.95,13.62 29.51,13.07 31.59,13.07 32.42,13.9 32.37,13.9 TP_SWO.TP
VBAT
  Top 0.15: 5.21,30.7 IC1.C2 | 10.61,33.99 C27.2 8.88,33.98 8.78,34.09
  Top 0.3: 8.78,34.09 C37.1 4.88,34.09 3.48,32.69 TP_VBAT.TP 3.74,32.17 5.21,30.7 | U3.3 U3.2 10.88,32.88 10.61,33.15 10.61,33.99
VBUS  (via drill 0.3)
  Top 0.15: 5.8,29.31 5.8,29.59 IC1.A2 | C42.2 C43.1 | 23.8,12.88 23.91,12.99 U1.P$AD2
  Top 0.3: 23.8,12.88 23.43,12.88 C21.1 19.31,12.22 16.4,15.13 v16.4,25.12 | J4.A4_B9 25.4,27.5 24.59,26.69 | 24.59,26.69 24.2,26.3 21.01,26.3 20.62,26.69 | 20.62,26.69 v16.4,26.69 10.18,26.69 9.1,27.77 9.1,28.13 | J4.A9_B4 20.6,26.71 20.62,26.69 | C43.1 29.66,29.48 29.9,29.24 29.9,28.1 28.49,26.69 24.59,26.69 | 5.8,29.31 5.8,28.86 | 5.8,28.86 5.8,26.72 4.85,25.77 C38.1 | D3.5 9.54,28.57 9.1,28.13 | 9.1,28.13 6.53,28.13 5.8,28.86
  Bottom 0.3: v16.4,25.12 v16.4,26.69
VREG  (via drill 0.3, 0.35)
  Top 0.15: IC1.B2 6.06,30.25 4.85,30.25 | C23.1 29.2,31.77 30.84,31.77 IC9.A3 IC9.A2 IC9.A1 33.09,31.94
  Top 0.3: 4.85,30.25 4.09,29.49 C39.1 4.47,29.06 v5.18,29.06 | C24.2 34.81,30.22 33.09,31.94 | C24.2 35.48,30.65 36.53,31.7 TP_VREG.TP | C24.2 35.48,29.28 32.13,25.93 32.07,25.87 32.01,25.81 9.35,25.81 v9.23,25.93
  GND 0.3: v9.23,25.93 8.31,25.93 v5.18,29.06
(copper drawn outside any net)
  shapes: GND area x1